# EAGLE design MainCPCB003 (EAGLE 9.4.2)
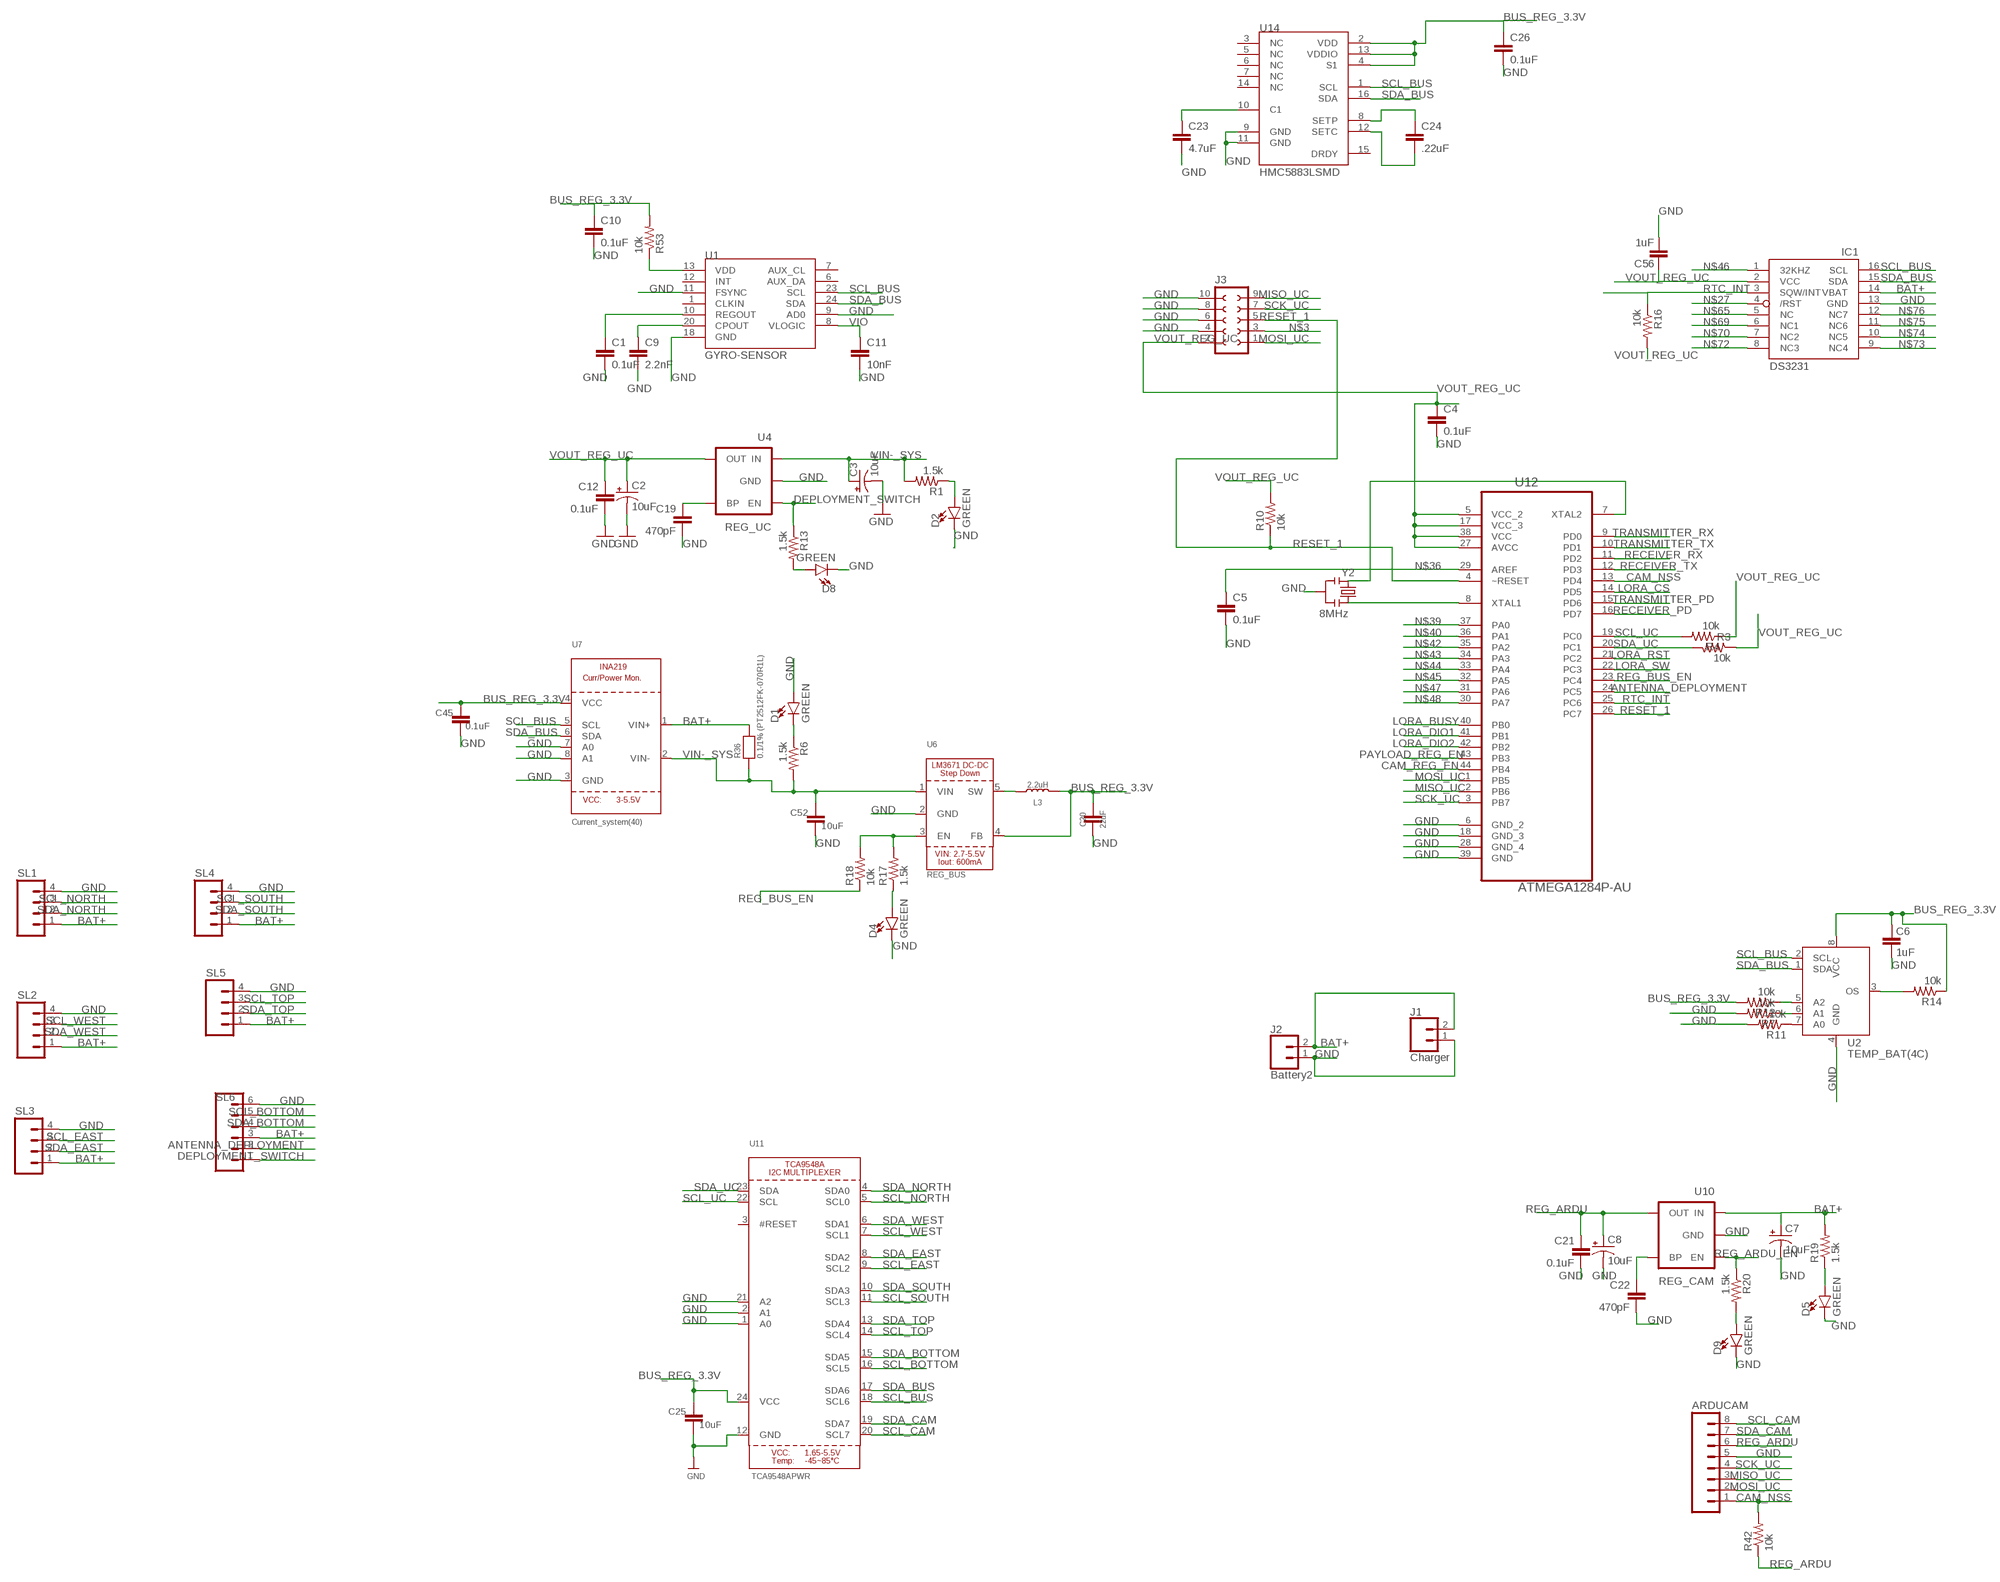
[diagram p0: schematic, sheet 1, part 1 of 2]
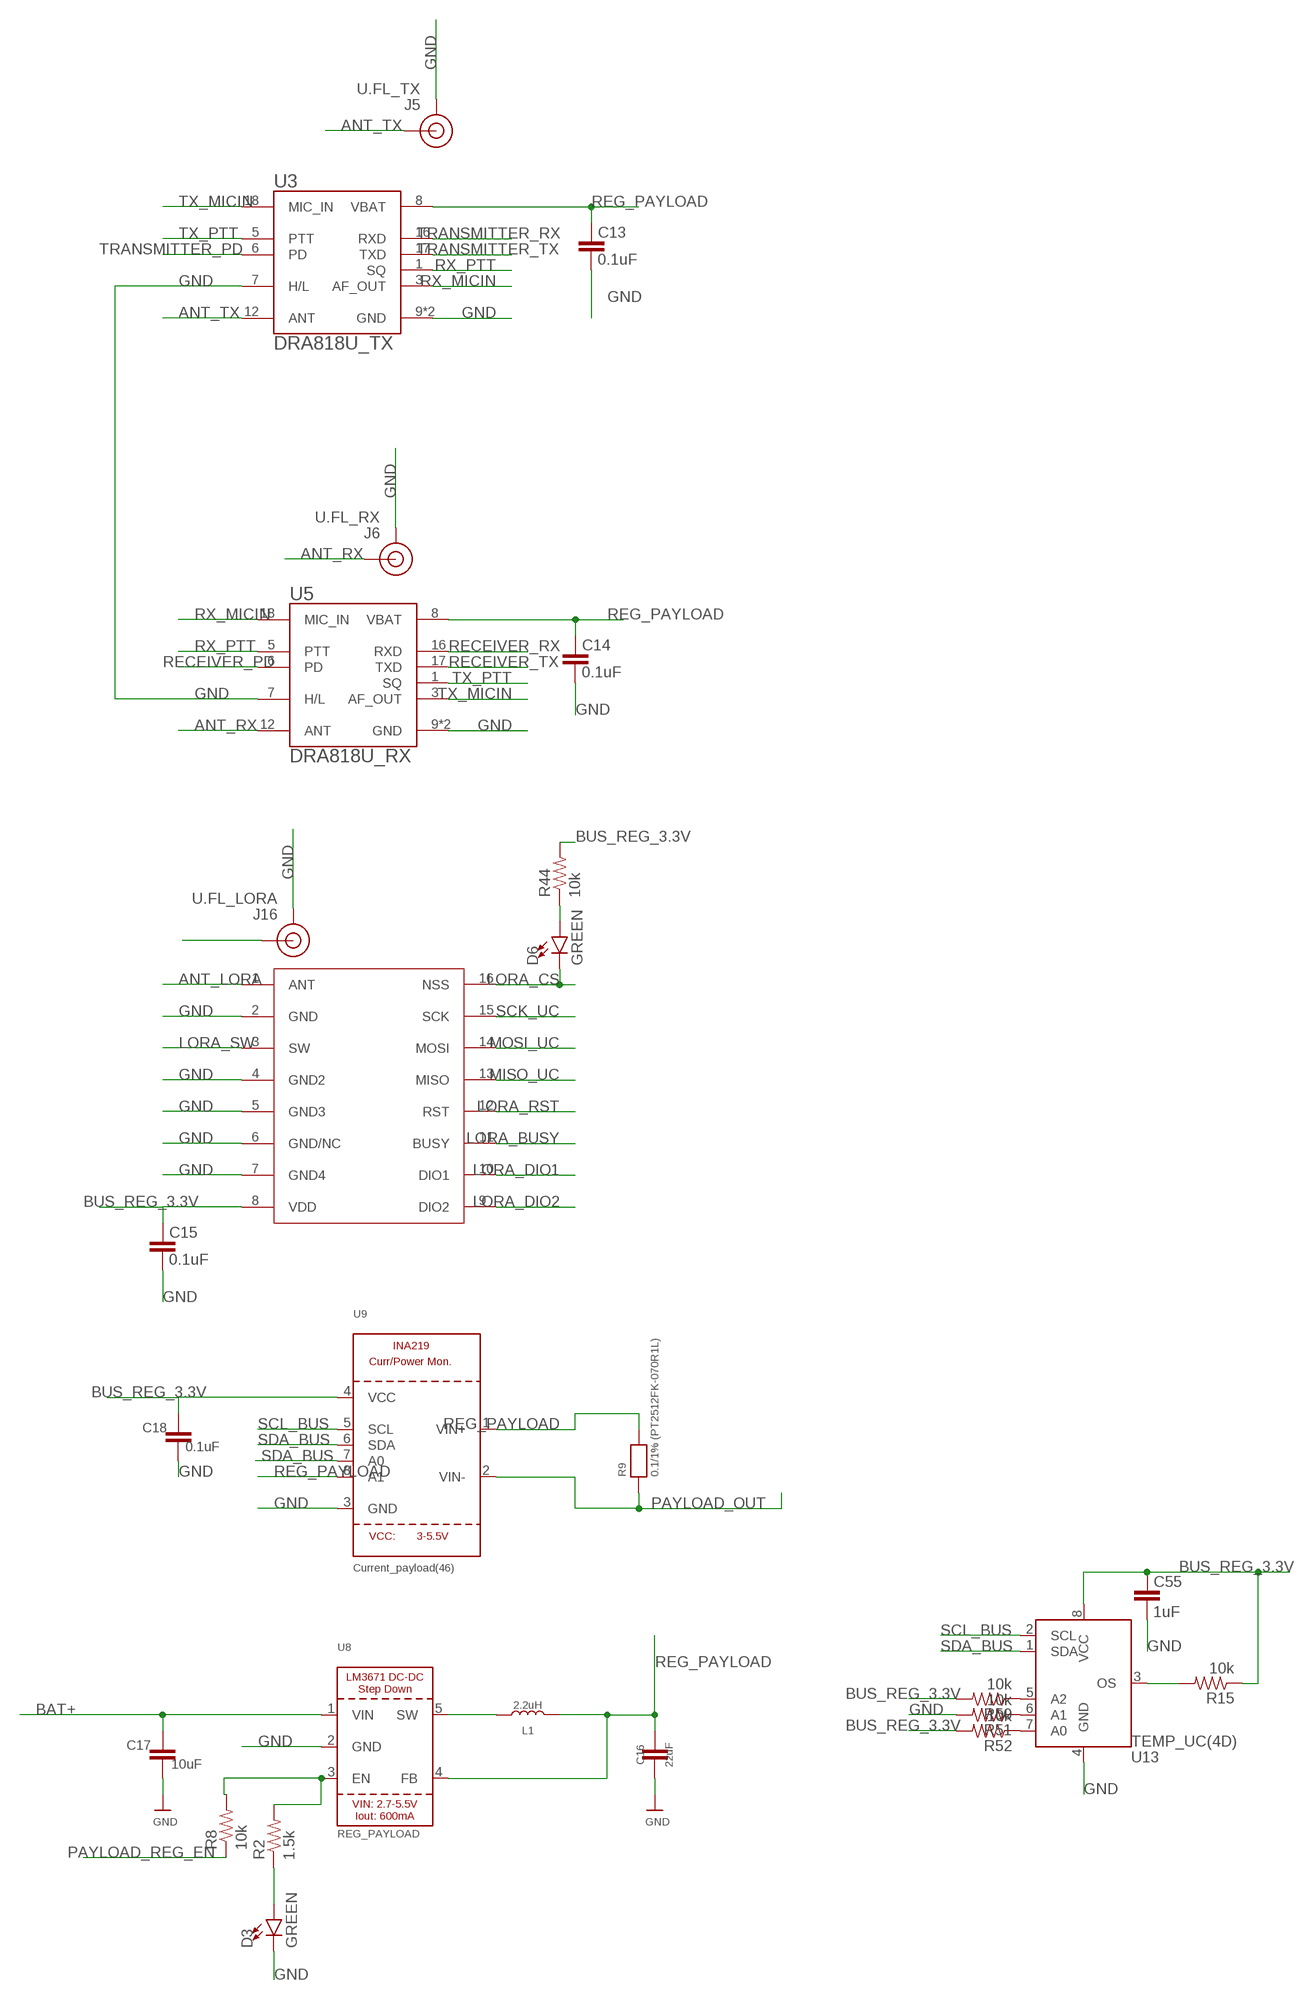
[diagram p1: schematic, sheet 1, part 2 of 2]

## Parts
ARDUCAM  M08  [08P]
C1  0.1uF  CAP0603-CAP  [0603-CAP]
C2  10uF  10UF-POLAR-0603-6.3V-20%(TANT)  [0603-POLAR]
C3  10uF  10UF-POLAR-0603-6.3V-20%(TANT)  [0603-POLAR]
C4  0.1uF  CAP0603-CAP  [0603-CAP]
C5  0.1uF  CAP0603-CAP  [0603-CAP]
C6  1uF  CAP0603-CAP  [0603-CAP]
C7  10uF  10UF-POLAR-0603-6.3V-20%(TANT)  [0603-POLAR]
C8  10uF  10UF-POLAR-0603-6.3V-20%(TANT)  [0603-POLAR]
C9  2.2nF  CAP0603-CAP  [0603-CAP]
C10  0.1uF  CAP0603-CAP  [0603-CAP]
C11  10nF  CAP0603-CAP  [0603-CAP]
C12  0.1uF  CAP0603-CAP  [0603-CAP]
C13  0.1uF  CAP0603-CAP  [0603-CAP]
C14  0.1uF  CAP0603-CAP  [0603-CAP]
C15  0.1uF  CAP0603-CAP  [0603-CAP]
C16  22uF  10UF-0603-6.3V-20%  [0603]
C17  10uF  10UF-0603-6.3V-20%  [0603]
C18  0.1uF  10UF-0603-6.3V-20%  [0603]
C19  470pF  CAP0603-CAP  [0603-CAP]
C20  22uF  10UF-0603-6.3V-20%  [0603]
C21  0.1uF  CAP0603-CAP  [0603-CAP]
C22  470pF  CAP0603-CAP  [0603-CAP]
C23  4.7uF  0.18UF-0603-10V-10%  [0603]
C24  .22uF  0.18UF-0603-10V-10%  [0603]
C25  10uF  10UF-0603-6.3V-20%  [0603]
C26  0.1uF  0.18UF-0603-10V-10%  [0603]
C45  0.1uF  10UF-0603-6.3V-20%  [0603]
C52  10uF  10UF-0603-6.3V-20%  [0603]
C55  1uF  CAP0603-CAP  [0603-CAP]
C56  1uF  CAP0603-CAP  [0603-CAP]
D1  GREEN  LED-GREEN0603  [LED-0603]
D2  GREEN  LED-GREEN0603  [LED-0603]
D3  GREEN  LED-GREEN0603  [LED-0603]
D4  GREEN  LED-GREEN0603  [LED-0603]
D5  GREEN  LED-GREEN0603  [LED-0603]
D6  GREEN  LED-GREEN0603  [LED-0603]
D8  GREEN  LED-GREEN0603  [LED-0603]
D9  GREEN  LED-GREEN0603  [LED-0603]
IC1  DS3231/SO  [SO16W]
J1  Charger  CONN_02  [1X02]
J2  Battery2  CONN_02  [1X02]
J3  SOCKET-10V  [S10V]
J5  U.FL_TX  U.FL2PIN  [U.FL]
J6  U.FL_RX  U.FL2PIN  [U.FL]
J16  U.FL_LORA  U.FL2PIN  [U.FL]
L1  2.2uH  INDUCTOR-0603-33NH  [0603]
L3  2.2uH  INDUCTOR-0603-33NH  [0603]
R1  1.5k  RESISTOR0603-RES  [0603-RES]
R2  1.5k  RESISTOR0603-RES  [0603-RES]
R3  10k  RESISTOR0603-RES  [0603-RES]
R4  10k  RESISTOR0603-RES  [0603-RES]
R6  1.5k  RESISTOR0603-RES  [0603-RES]
R7  10k  RESISTOR0603-RES  [0603-RES]
R8  10k  RESISTOR0402-RES  [0402-RES]
R9  0.1/1% (PT2512FK-070R1L)  RESISTOR2512  [2512]
R10  10k  RESISTOR0402-RES  [0402-RES]
R11  10k  RESISTOR0603-RES  [0603-RES]
R12  10k  RESISTOR0603-RES  [0603-RES]
R13  1.5k  RESISTOR0603-RES  [0603-RES]
R14  10k  RESISTOR0603-RES  [0603-RES]
R15  10k  RESISTOR0603-RES  [0603-RES]
R16  10k  RESISTOR0603-RES  [0603-RES]
R17  1.5k  RESISTOR0603-RES  [0603-RES]
R18  10k  RESISTOR0603-RES  [0603-RES]
R19  1.5k  RESISTOR0603-RES  [0603-RES]
R20  1.5k  RESISTOR0603-RES  [0603-RES]
R36  0.1/1% (PT2512FK-070R1L)  RESISTOR2512  [2512]
R42  10k  RESISTOR0603-RES  [0603-RES]
R44  10k  RESISTOR0603-RES  [0603-RES]
R50  10k  RESISTOR0603-RES  [0603-RES]
R51  10k  RESISTOR0603-RES  [0603-RES]
R52  10k  RESISTOR0603-RES  [0603-RES]
R53  10k  RESISTOR0603-RES  [0603-RES]
SL1  M04  [04P]
SL2  M04  [04P]
SL3  M04  [04P]
SL4  M04  [04P]
SL5  M04  [04P]
SL6  M06  [06P]
U1  GYRO-SENSOR  MPU-6050-1  [QFN-24-4MM2]
U2  TEMP_BAT(4C)  LM75BDP  [SOT505-1]
U3  DRA818U_TX  DRA818U  [DORJI_DRA818U]
U4  REG_UC  V_REG_LDOSMD  [SOT23-5]
U5  DRA818U_RX  DRA818U  [DORJI_DRA818U]
U6  REG_BUS  VREG_LM3671  [SOT23-5]
U7  Current_system(40)  INA219  [SOT23-8]
U8  REG_PAYLOAD  VREG_LM3671  [SOT23-5]
U9  Current_payload(46)  INA219  [SOT23-8]
U10  REG_CAM  V_REG_LDOSMD  [SOT23-5]
U11  TCA9548APWR  TCA9548A  [TSSOP24]
U12  ATMEGA1284P-AU  [QFP80P1200X1200X120-44N]
U13  TEMP_UC(4D)  LM75BDP  [SOT505-1]
U14  HMC5883LSMD  [16LPCC]
U$1  DRF1268  [RESCAV180P1570X1400X300-16]
Y2  RESONATORSMD  [RESONATOR-SMD]

## Nets
ANT_LORA: J16.FEED(SIGNAL) U$1.1(ANT)
ANT_RX: J6.FEED(SIGNAL) U5.12(ANT)
ANT_TX: J5.FEED(SIGNAL) U3.12(ANT)
ANTENNA_DEPLOYMENT: SL6.2 U12.24(PC5)
BAT+: C7.+ C17.1 IC1.14(VBAT) J1.2 J2.2 R19.2 R36.2 SL1.1 SL2.1 SL3.1 SL4.1 SL5.1 SL6.3 U7.1(VIN+) U8.1(VIN) U10.1(IN)
BUS_REG_3.3V: C6.2 C10.1 C15.2 C18.1 C20.1 C25.1 C26.1 C45.1 C55.2 L3.2 R12.2 R14.1 R15.1 R44.2 R50.2 R52.2 R53.2 U2.8(VCC) U6.4(FB) U7.4(VCC) U9.4(VCC) U11.24(VCC) U13.8(VCC) U14.2(VDD) U14.4(S1) U14.13(VDDIO) U$1.8(VDD)
CAM_NSS: ARDUCAM.1 R42.2 U12.13(PD4)
CAM_REG_EN: U12.44(PB4)
DEPLOYMENT_SWITCH: R13.1 SL6.1 U4.3(EN)
GND: ARDUCAM.5 C1.2 C2.- C3.- C4.2 C5.2 C6.1 C7.- C8.- C9.2 C10.2 C11.2 C12.2 C13.1 C14.1 C15.1 C16.2 C17.2 C18.2 C19.2 C20.2 C21.2 C22.2 C23.2 C25.2 C26.2 C45.2 C52.2 C55.1 C56.1 D1.A D2.C D3.C D4.C D5.C D8.C D9.C IC1.13(GND) J1.1 J2.1 J3.4 J3.6 J3.8 J3.10 J5.1(GND) J5.2(GND) J6.1(GND) J6.2(GND) J16.1(GND) J16.2(GND) R7.2 R11.2 R51.2 SL1.4 SL2.4 SL3.4 SL4.4 SL5.4 SL6.6 U1.9(AD0) U1.11(FSYNC) U1.18(GND) U2.4(GND) U3.7(H/L) U3.9(GND) U3.10(GND) U4.2(GND) U5.7(H/L) U5.9(GND) U5.10(GND) U6.2(GND) U7.3(GND) U7.7(A0) U7.8(A1) U8.2(GND) U9.3(GND) U10.2(GND) U11.1(A0) U11.2(A1) U11.12(GND) U11.21(A2) U12.6(GND_2) U12.18(GND_3) U12.28(GND_4) U12.39(GND) U13.4(GND) U14.9(GND) U14.11(GND) U$1.2(GND) U$1.4(GND2) U$1.5(GND3) U$1.6(GND/NC) U$1.7(GND4) Y2.2
LORA_BUSY: U12.40(PB0) U$1.11(BUSY)
LORA_CS: D6.C U12.14(PD5) U$1.16(NSS)
LORA_DIO1: U12.41(PB1) U$1.10(DIO1)
LORA_DIO2: U12.42(PB2) U$1.9(DIO2)
LORA_RST: U12.21(PC2) U$1.12(RST)
LORA_SW: U12.22(PC3) U$1.3(SW)
MISO_UC: ARDUCAM.3 J3.9 U12.2(PB6) U$1.13(MISO)
MOSI_UC: ARDUCAM.2 J3.1 U12.1(PB5) U$1.14(MOSI)
N$1: D5.A R19.1
N$2: D8.A R13.2
N$3: J3.3
N$4: R7.1 U2.6(A1)
N$5: D4.A R17.1
N$6: D3.A R2.1
N$7: D2.A R1.1
N$8: R17.2 R18.2 U6.3(EN)
N$9: R2.2 R8.2 U8.3(EN)
N$10: D1.C R6.1
N$11: D6.A R44.1
N$14: L1.1 U8.5(SW)
N$15: C22.1 U10.4(BP)
N$16: U12.7(XTAL2) Y2.1
N$18: D9.A R20.2
N$21: C24.1 U14.8(SETP)
N$26: C24.2 U14.12(SETC)
N$27: IC1.4(/RST)
N$28: C23.1 U14.10(C1)
N$29: L3.1 U6.5(SW)
N$30: C19.1 U4.4(BP)
N$31: C9.1 U1.20(CPOUT)
N$32: C1.1 U1.10(REGOUT)
N$33: U12.8(XTAL1) Y2.3
N$34: R53.1 U1.13(VDD)
N$35: R12.1 U2.5(A2)
N$36: C5.1 U12.29(AREF)
N$37: R11.1 U2.7(A0)
N$39: U12.37(PA0)
N$40: U12.36(PA1)
N$42: U12.35(PA2)
N$43: U12.34(PA3)
N$44: U12.33(PA4)
N$45: U12.32(PA5)
N$46: IC1.1(32KHZ)
N$47: U12.31(PA6)
N$48: U12.30(PA7)
N$54: R14.2 U2.3(OS)
N$55: R50.1 U13.5(A2)
N$56: R51.1 U13.6(A1)
N$57: R52.1 U13.7(A0)
N$58: R15.2 U13.3(OS)
N$65: IC1.5(NC)
N$69: IC1.6(NC1)
N$70: IC1.7(NC2)
N$72: IC1.8(NC3)
N$73: IC1.9(NC4)
N$74: IC1.10(NC5)
N$75: IC1.11(NC6)
N$76: IC1.12(NC7)
PAYLOAD_OUT: R9.1 U9.2(VIN-)
PAYLOAD_REG_EN: R8.1 U12.43(PB3)
RECEIVER_PD: U5.6(PD) U12.16(PD7)
RECEIVER_RX: U5.16(RXD) U12.11(PD2)
RECEIVER_TX: U5.17(TXD) U12.12(PD3)
REG_ARDU: ARDUCAM.6 C8.+ C21.1 R42.1 U10.5(OUT)
REG_ARDU_EN: R20.1 U10.3(EN)
REG_BUS_EN: R18.1 U12.23(PC4)
REG_PAYLOAD: C13.2 C14.2 C16.1 L1.2 R9.2 U3.8(VBAT) U5.8(VBAT) U8.4(FB) U9.1(VIN+) U9.8(A1)
RESET_1: J3.5 R10.1 U12.4(~RESET) U12.26(PC7)
RTC_INT: IC1.3(SQW/INT) R16.1 U12.25(PC6)
RX_MICIN: U3.3(AF_OUT) U5.18(MIC_IN)
RX_PTT: U3.1(SQ) U5.5(PTT)
SCK_UC: ARDUCAM.4 J3.7 U12.3(PB7) U$1.15(SCK)
SCL_BOTTOM: SL6.5 U11.16(SCL5)
SCL_BUS: IC1.16(SCL) U1.23(SCL) U2.2(SCL) U7.5(SCL) U9.5(SCL) U11.18(SCL6) U13.2(SCL) U14.1(SCL)
SCL_CAM: ARDUCAM.8 U11.20(SCL7)
SCL_EAST: SL3.3 U11.9(SCL2)
SCL_NORTH: SL1.3 U11.5(SCL0)
SCL_SOUTH: SL4.3 U11.11(SCL3)
SCL_TOP: SL5.3 U11.14(SCL4)
SCL_UC: R4.2 U11.22(SCL) U12.19(PC0)
SCL_WEST: SL2.3 U11.7(SCL1)
SDA_BOTTOM: SL6.4 U11.15(SDA5)
SDA_BUS: IC1.15(SDA) U1.24(SDA) U2.1(SDA) U7.6(SDA) U9.6(SDA) U9.7(A0) U11.17(SDA6) U13.1(SDA) U14.16(SDA)
SDA_CAM: ARDUCAM.7 U11.19(SDA7)
SDA_EAST: SL3.2 U11.8(SDA2)
SDA_NORTH: SL1.2 U11.4(SDA0)
SDA_SOUTH: SL4.2 U11.10(SDA3)
SDA_TOP: SL5.2 U11.13(SDA4)
SDA_UC: R3.2 U11.23(SDA) U12.20(PC1)
SDA_WEST: SL2.2 U11.6(SDA1)
TRANSMITTER_PD: U3.6(PD) U12.15(PD6)
TRANSMITTER_RX: U3.16(RXD) U12.9(PD0)
TRANSMITTER_TX: U3.17(TXD) U12.10(PD1)
TX_MICIN: U3.18(MIC_IN) U5.3(AF_OUT)
TX_PTT: U3.5(PTT) U5.1(SQ)
VIN-_SYS: C3.+ C52.1 R1.2 R6.2 R36.1 U4.1(IN) U6.1(VIN) U7.2(VIN-)
VIO: C11.1 U1.8(VLOGIC)
VOUT_REG_UC: C2.+ C4.1 C12.1 C56.2 IC1.2(VCC) J3.2 R3.1 R4.1 R10.2 R16.2 U4.5(OUT) U12.5(VCC_2) U12.17(VCC_3) U12.27(AVCC) U12.38(VCC)
Unconnected: U1.1(CLKIN) U1.6(AUX_DA) U1.7(AUX_CL) U1.12(INT) U11.3(#RESET) U14.3(NC) U14.5(NC) U14.6(NC) U14.7(NC) U14.14(NC) U14.15(DRDY)

## Notes on the sheet
- 8MHz

## Library data of the parts
ARDUCAM = con-amp-quick:M08: AMP QUICK CONNECTOR; OC_FARNELL: unknown; OC_NEWARK: unknown
C1 C4-C6 C9-C15 C19 C21 C22 C55 C56 = SparkFun:CAP: Capacitor Standard 0603 ceramic capacitor, and 0.1" leaded capacitor.
C2 C3 C7 C8 = SparkFun-Capacitors:10UF-POLAR: 10.0µF polarized capacitors A capacitor is a passive two-terminal electrical component used to store electrical energy temporarily in an electric field.; PROD_ID: CAP-13210
C16 C18 C20 C45 = SparkFun-Capacitors:10UF: 10.0µF ceramic capacitors A capacitor is a passive two-terminal electrical component used to store electrical energy temporarily in an electric field.; PROD_ID: CAP-11015; VALUE: 10uF
C17 C25 C52 = SparkFun-Capacitors:10UF: 10.0µF ceramic capacitors A capacitor is a passive two-terminal electrical component used to store electrical energy temporarily in an electric field.; PROD_ID: CAP-11015
C23 C24 C26 = SparkFun-Capacitors:0.18UF: 0.18µF ceramic capacitor A capacitor is a passive two-terminal electrical component used to store electrical energy temporarily in an electric field.; PROD_ID: CAP-12380; VALUE: 0.18uF
D1-D6 D8 D9 = SparkFun-LED:LED-GREEN: Green SMD LED Used in manufacturing of various products at SparkFun Packages: 0603 - SMD 0603 package [Product Link] <http://www.futureelectronics.com/en/technologies/semiconductors/optoelectronics/leds/Pages/9894312-LTST-C190GKT.aspx?CrossPart=HSMG-C190&IM=0> LilyPad 1206 - SMD1206 LilyPad package [Product Link] <http://www.futureelectronics.com/en/Technologies/Product.aspx?ProductID=IN150NGHARVATEKCORPORATION2049943&IM=0> 1206 - SMD1206 package [Product Link] <http://www.futureelectronics.com/en/technologies/semiconductors/optoelectronics/leds/Pages/8315665-LTST-C150KGKT.aspx?IM=0> 1206 Bottom Mount -SMD 1206 Bottom Mount [Product Link] <http://www.digikey.com/product-detail/en/lite-on-inc/LTST-C230KGKT/160-1456-1-ND/386854> SparkFun Products: Pro Mini 328 -5V <https://www.sparkfun.com/products/821> RedBoard <https://www.sparkfun.com/products/12757> MP3 Trigger <https://www.sparkfun.com/products/13720> Makey Makey <https://www.sparkfun.com/products/11076>; PROD_ID: DIO-00821
IC1 = DS3231:DS3231: The DS3231 is a low-cost, extremely accurate I²C real-time clock (RTC) with an integrated temperature-compensated crystal oscillator (TCXO) and crystal. The device incorporates a battery input, and maintains accurate timekeeping when main power to the device is interrupted.; AVAILABILITY: Unavailable; MF: Maxim Integrated; MP: DS3231; PACKAGE: SOIC-16 Maxim Integrated; PRICE: None
J1 J2 = SparkFun-Connectors:CONN_02: Multi connection point. Often used as Generic Header-pin footprint for 0.1 inch spaced/style header connections On any of the 0.1 inch spaced packages, you can populate with these: Break Away Headers - Straight <https://www.sparkfun.com/products/116> (PRT-00116) Break Away Male Headers - Right Angle <https://www.sparkfun.com/products/553> (PRT-00553) Female Headers <https://www.sparkfun.com/products/115> (PRT-00115) Break Away Headers - Machine Pin <https://www.sparkfun.com/products/117> (PRT-00117) Break Away Female Headers - Swiss Machine Pin <https://www.sparkfun.com/products/743> (PRT-00743) For SCREWTERMINALS and SPRING TERMINALS visit here: Screw Terimnals on SparkFun.com <https://www.sparkfun.com/search/results?term=Screw+Terminals> (5mm/3.5mm/2.54mm spacing) This device is also useful as a general connection point to wire up your design to another part of your project. Our various solder wires solder well into these plated through hole pads. Hook-Up Wire - Assortment (Stranded, 22 AWG) <https://www.sparkfun.com/products/11375> (PRT-11375) Hook-Up Wire - Assortment (Solid Core, 22 AWG) <https://www.sparkfun.com/products/11367> (PRT-11367) View the entire wire category on our website here <https://www.sparkfun.com/categories/141> Special notes: Molex polarized connector foot print use with: PRT-08233 with associated crimp pins and housings. 2.54_SCREWTERM for use with PRT-10571. 3.5mm Screw Terminal footprints for PRT-08084 5mm Screw Terminal footprints for use with PRT-08432
J3 = con-3m-skt-header:SOCKET-10: 10 pin PCB Socket (3m 85xx/51xx)
J5 J6 J16 = SparkFun-Connectors:U.FL2PIN: SMD Antenna Connector - U.FL 2mm height, 3.0mm x 3.0mm receptacle size. SparkFun Products: SparkFun WiFi Shield - ESP8266 <https://www.sparkfun.com/products/13287> SparkFun ESP8266 Thing <https://www.sparkfun.com/products/13231> SparkFun MiniGen - Pro Mini Signal Generator Shield <https://www.sparkfun.com/products/11420>; PROD_ID: CONN-09193; SF_ID: WRL-09144; VALUE: U.FL
L1 L3 = SparkFun-Coils:INDUCTOR: Inductors Resist changes in electrical current. Basically a coil of wire. SparkFun Products: SparkFun Load Cell Amplifier - HX711 <https://www.sparkfun.com/products/13879> IOIO-OTG - V2.2 <https://www.sparkfun.com/products/13613>; PROD_ID: NDUC-07874; VALUE: 33nH/±5%/500mA
R1-R4 R6-R8 R10-R20 R42 R44 R50-R53 = SparkFun:RESISTOR: Resistor Basic schematic elements and footprints for 0603, 1206, and PTH resistors.
R9 R36 = microbuilder:RESISTOR: Resistors For new designs, use the packages preceded by an '_' character since they are more reliable: The following footprints should be used on most boards: _0402 - Standard footprint for regular board layouts _0603 - Standard footprint for regular board layouts _0805 - Standard footprint for regular board layouts _1206 - Standard footprint for regular board layouts For extremely tight-pitch boards where space is at a premium, the following 'micro-pitch' footprints can be used (smaller pads, no silkscreen outline, etc.): _0402MP - Micro-pitch footprint for very dense/compact boards _0603MP - Micro-pitch footprint for very dense/compact boards _0805MP - Micro-pitch footprint for very dense/compact boards _1206MP - Micro-pitch footprint for very dense/compact boards
SL1-SL5 = con-amp-quick:M04: AMP QUICK CONNECTOR; OC_FARNELL: unknown; OC_NEWARK: unknown
SL6 = con-amp-quick:M06: AMP QUICK CONNECTOR; OC_FARNELL: unknown; OC_NEWARK: unknown
U1 = Testing:MPU-6050
U2 U13 = LM75B:LM75B: Digital temperature sensor and thermal watchdog AAL Eindhoven MK; AVAILABILITY: Unavailable; MF: NXP Semiconductors; MP: LM75B; PACKAGE: None; PRICE: None
U3 U5 = DRA818U:DRA818U: VHF Band Voice Transceiver Module; AVAILABILITY: Unavailable; MF: DORJI; MP: DRA818V; PACKAGE: Package Analog Devices; PRICE: None
U4 U10 = SparkFun:V_REG_LDO: Voltage Regulator LDO Standard 150mA LDO voltage regulator in SOT-23 layout. Micrel part MIC5205. BP (by-pass) pin is used to lower output noise with 470pF cap.
U6 U8 = microbuilder:VREG_LM3671: LM3671 - 600mA DC-DC Step-Down Converter VIN: 2.7-5.5V Load Current: 600mA Switching Frequency: 2MHz Iq: 16uA
U7 U9 = microbuilder:INA219: INA219 - I2C Current/Power Monitor Voltage Range: 0-26V Accuracy: 0.5% Temperature: -40°C - 125°C
U11 = microbuilder:TCA9548A: TCA9548A I2C Multiplexer
U12 = ATMEGA1284P-AU:ATMEGA1284P-AU: Microcontroller with Programmable Flash; AVAILABILITY: Unavailable; DESCRIPTION: AVR AVR® ATmega Microcontroller IC 8-Bit 20MHz 128KB _64K x 16_ FLASH 44-TQFP _10x10_; MF: Microchip; MP: ATMEGA1284P-AU; PACKAGE: TQFP-44 Microchip; PRICE: None
U14 = SparkFun:HMC5883L: 3 Axis Digital Compass IC
U$1 = DRF1268:DRF1268
Y2 = SparkFun:RESONATOR: Resonator Small SMD resonator. This is the itty bitty 10/20MHz resonators with built in caps. CSTCE10M0G55 and CSTCE20M0V53. Footprint has been reviewed closely but hasn't been tested yet.

## Board
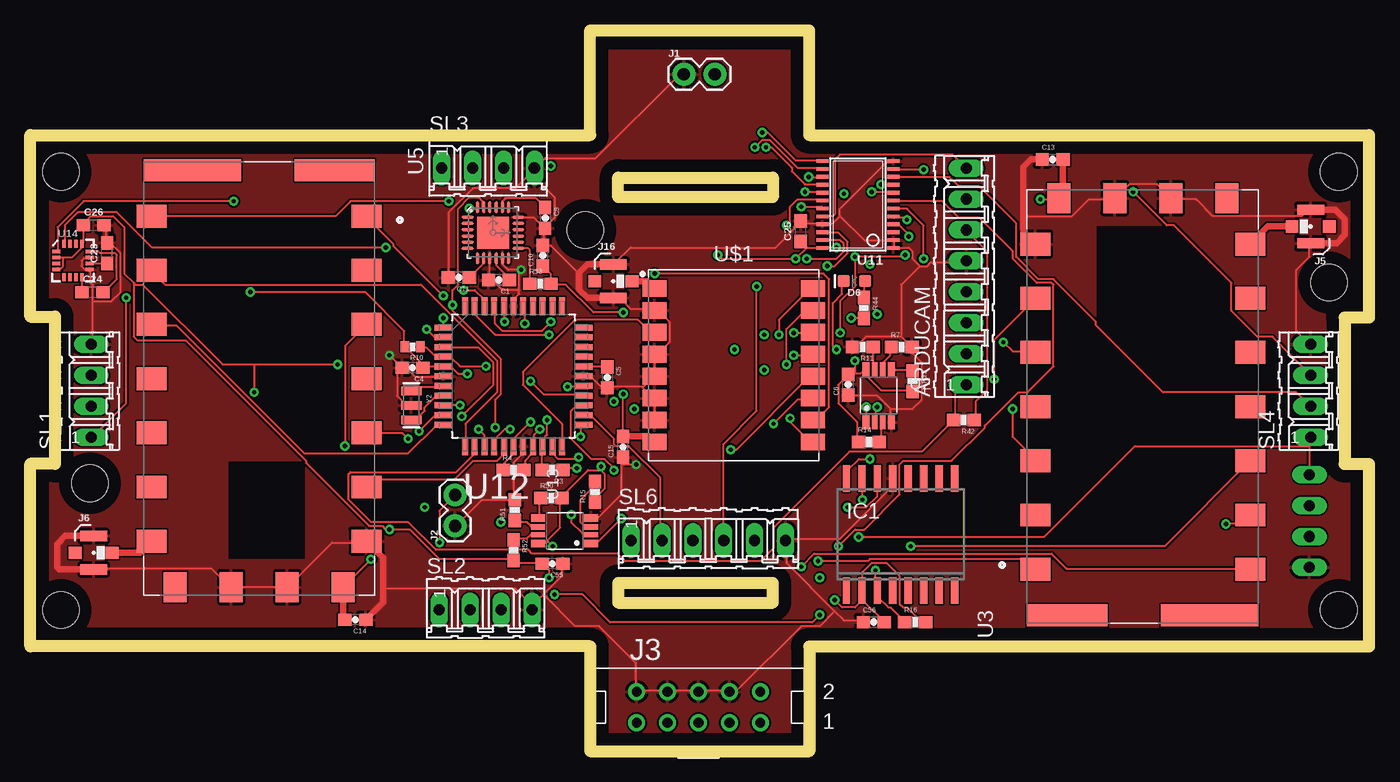
[diagram p2: board, top side]
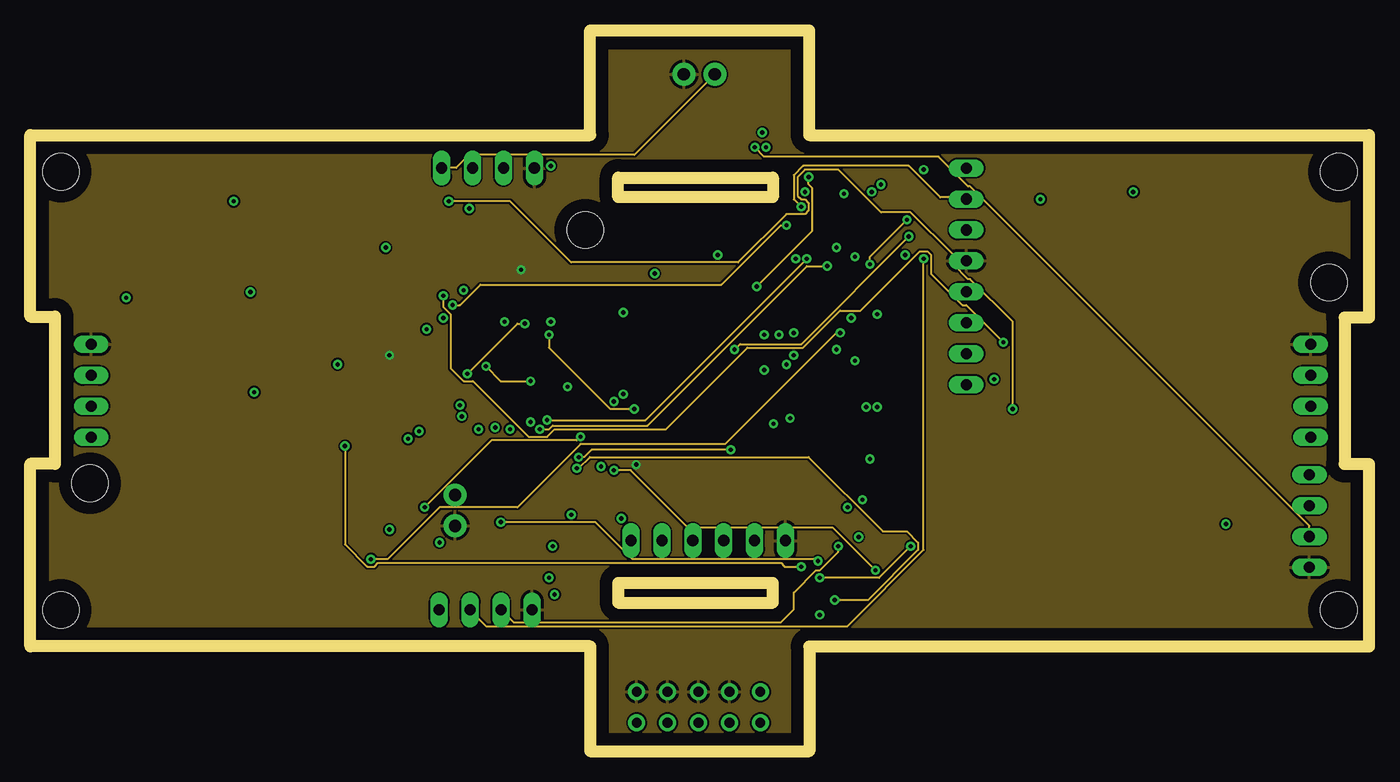
[diagram p3: board, inner layer Route2]
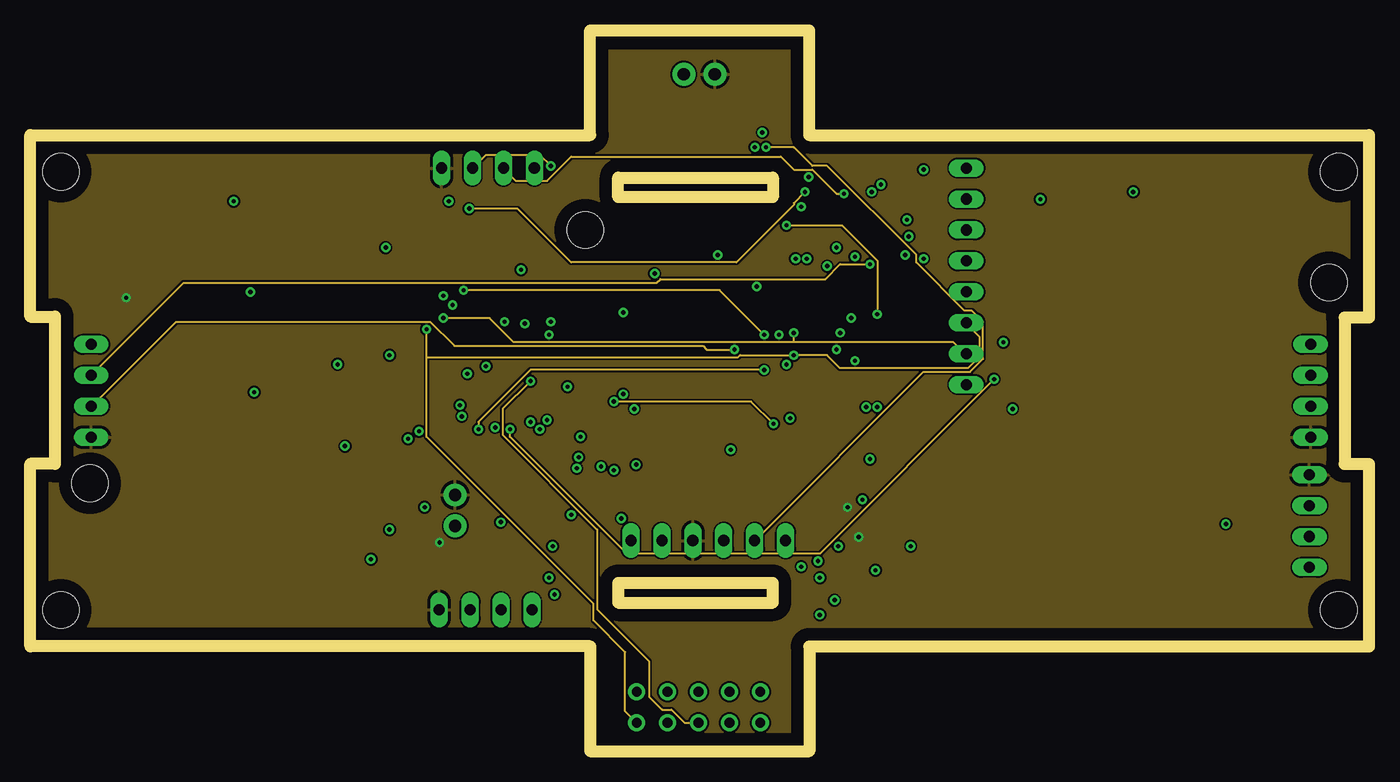
[diagram p4: board, inner layer Route15]
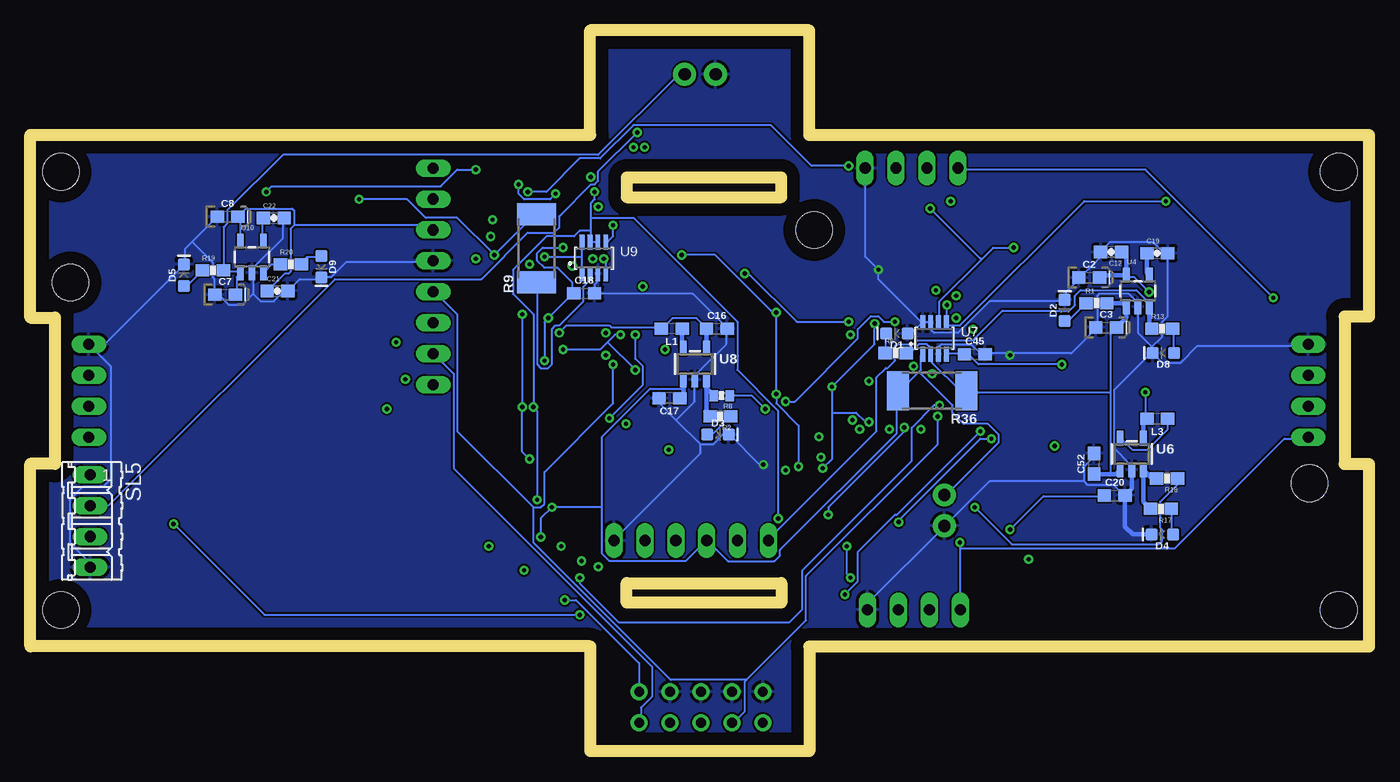
[diagram p5: board, bottom side, seen from below]

Size 110 x 59.2 mm. Coordinates in mm from the lower left corner, seen from the top.
Outline: 0,50.6 46,50.6 46,59.2 64,59.2 64,50.6 110,50.6 110,35.6 108,35.6 108,23.6 110,23.6 110,8.6 64,8.6 64,0 46,0 46,8.6 0,8.6 0,23.6 2,23.6 2,35.7 0,35.7 0,50.6
Outline: 48.3,47.1 61,47.1 61,45.5 48.3,45.5 48.3,47.1
Outline: 48.3,12.2 61,12.2 61,13.8 48.3,13.8 48.3,12.2
Copper layers (1+2*15+16): Top 0.035mm / dielectric 0.2mm / Route2 0.0175mm / dielectric 1.065mm / Route15 0.0175mm / dielectric 0.2mm / Bottom 0.035mm
Design rules "default *": minimum track width 6mil, minimum drill 0.35mm, track to track 6mil, track to pad 6mil, pad to pad 6mil, via to via 6mil, smd to smd 6mil, copper to edge 40mil, drill to drill 6mil, minimum pad ring 10mil, minimum via ring 8mil, stop-mask expansion 4mil, vias tented up to drill 0mil, thermal gap 10mil
Holes 3 mm at 2.5,47.6 2.5,11.6 107.5,11.6 107.5,47.6 4.9,22 45.6,42.8 106.7,38.5

### Footprints (pad centres in the part's own frame; a part is rotated, then mirrored left to right if it is on the bottom)
08P = drill 0.914 long: 1 -8.89,0; 2 -6.35,0; 3 -3.81,0; 4 -1.27,0; 5 1.27,0; 6 3.81,0; 7 6.35,0; 8 8.89,0
0603-CAP = smd 1.1 x 1: 1 -0.85,0; 2 0.85,0
0603-POLAR = smd 1.1 x 1: + 0.85,0; - -0.85,0
0603 = smd 1.1 x 1: 1 -0.85,0; 2 0.85,0
LED-0603 = smd 1 x 1: A -0.877,0; C 0.877,0
SO16W = smd 0.6 x 2.2: 1 -4.445,-4.6; 2 -3.175,-4.6; 3 -1.905,-4.6; 4 -0.635,-4.6; 5 0.635,-4.6; 6 1.905,-4.6; 7 3.175,-4.6; 8 4.445,-4.6; 9 4.445,4.6; 10 3.175,4.6; 11 1.905,4.6; 12 0.635,4.6; 13 -0.635,4.6; 14 -1.905,4.6; 15 -3.175,4.6; 16 -4.445,4.6
1X02 = drill 1.016 pad 1.88: 1 0,0; 2 2.54,0
S10V = drill 0.8 pad 1.4: 1 5.08,-1.27; 2 5.08,1.27; 3 2.54,-1.27; 4 2.54,1.27; 5 0,-1.27; 6 0,1.27; 7 -2.54,-1.27; 8 -2.54,1.27; 9 -5.08,-1.27; 10 -5.08,1.27
U.FL = smd 2.2 x 0.85: 1 0,1.375; 2 0,-1.375 | smd 1.05 x 1: FEED 1.525,0; NC -1.525,0
0603-RES = smd 1.1 x 1: 1 -0.85,0; 2 0.85,0
0402-RES = smd 0.7 x 0.9: 1 -0.65,0; 2 0.65,0
2512 = smd 1.8 x 3.2: 1 -2.8,0; 2 2.8,0
04P = drill 0.914 long: 1 -3.81,0; 2 -1.27,0; 3 1.27,0; 4 3.81,0
06P = drill 0.914 long: 1 -6.35,0; 2 -3.81,0; 3 -1.27,0; 4 1.27,0; 5 3.81,0; 6 6.35,0
QFN-24-4MM2 = smd 1.016 x 0.254: 1 -2.066,1.257; 2 -2.066,0.75; 3 -2.066,0.247; 4 -2.066,-0.287; 5 -2.066,-0.792; 6 -2.066,-1.297; 13 2.086,-1.297; 14 2.086,-0.792; 15 2.086,-0.287; 16 2.086,0.247; 17 2.086,0.75; 18 2.086,1.257 | smd 0.254 x 1.016: 7 -1.267,-2.122; 8 -0.762,-2.122; 9 -0.258,-2.122; 10 0.278,-2.122; 11 0.78,-2.122; 12 1.287,-2.122; 19 1.287,2.082; 20 0.78,2.082; 21 0.278,2.082; 22 -0.258,2.082; 23 -0.762,2.082; 24 -1.267,2.082 | smd 2.616 x 2.616: P$1 0.02,-0.01
SOT505-1 = smd 0.6 x 1.15: 1 -1.05,-2.175; 4 1.05,-2.175; 5 1.05,2.175; 8 -1.05,2.175 | smd 0.45 x 1.15: 2 -0.325,-2.175; 3 0.325,-2.175; 6 0.325,2.175; 7 -0.325,2.175
DORJI_DRA818U = smd 1.88 x 2.47: 1 -13.35,8.825; 2 -8.9,8.825; 3 -4.45,8.825; 4 0,8.825; 5 4.45,8.825; 6 8.9,8.825; 7 13.35,8.825; 12 13.35,-8.825; 13 8.9,-8.825; 14 4.45,-8.825; 15 0,-8.825; 16 -4.45,-8.825; 17 -8.9,-8.825; 18 -13.35,-8.825 | smd 2.47 x 1.88: 8 17.125,6.9; 9 17.125,2.3; 10 17.125,-2.3; 11 17.125,-6.9 | smd 1.8 x 6.6: P2 -17.125,6.2 | smd 1.8 x 8: P3 -17.125,-5.5
SOT23-5 = smd 0.55 x 1.2: 1 -0.95,-1.3; 2 0,-1.3; 3 0.95,-1.3; 4 0.95,1.3; 5 -0.95,1.3
SOT23-8 = smd 0.4 x 1.2: 1 -0.975,-1.3; 2 -0.325,-1.3; 3 0.325,-1.3; 4 0.975,-1.3; 5 0.975,1.3; 6 0.325,1.3; 7 -0.325,1.3; 8 -0.975,1.3
TSSOP24 = smd 0.305 x 0.991: 1 -3.575,-2.918; 2 -2.925,-2.918; 3 -2.275,-2.918; 4 -1.625,-2.918; 5 -0.975,-2.918; 6 -0.325,-2.918; 7 0.325,-2.918; 8 0.975,-2.918; 9 1.625,-2.918; 10 2.275,-2.918; 11 2.925,-2.918; 12 3.575,-2.918; 13 3.575,2.918; 14 2.925,2.918; 15 2.275,2.918; 16 1.625,2.918; 17 0.975,2.918; 18 0.325,2.918; 19 -0.325,2.918; 20 -0.975,2.918; 21 -1.625,2.918; 22 -2.275,2.918; 23 -2.925,2.918; 24 -3.575,2.918
QFP80P1200X1200X120-44N = smd 1.473 x 0.508: 1 -5.74,3.988; 2 -5.74,3.2; 3 -5.74,2.388; 4 -5.74,1.6; 5 -5.74,0.787; 6 -5.74,0; 7 -5.74,-0.787; 8 -5.74,-1.6; 9 -5.74,-2.388; 10 -5.74,-3.2; 11 -5.74,-3.988; 23 5.74,-3.988; 24 5.74,-3.2; 25 5.74,-2.388; 26 5.74,-1.6; 27 5.74,-0.787; 28 5.74,0; 29 5.74,0.787; 30 5.74,1.6; 31 5.74,2.388; 32 5.74,3.2; 33 5.74,3.988 | smd 0.508 x 1.473: 12 -3.988,-5.74; 13 -3.2,-5.74; 14 -2.388,-5.74; 15 -1.6,-5.74; 16 -0.787,-5.74; 17 0,-5.74; 18 0.787,-5.74; 19 1.6,-5.74; 20 2.388,-5.74; 21 3.2,-5.74; 22 3.988,-5.74; 34 3.988,5.74; 35 3.2,5.74; 36 2.388,5.74; 37 1.6,5.74; 38 0.787,5.74; 39 0,5.74; 40 -0.787,5.74; 41 -1.6,5.74; 42 -2.388,5.74; 43 -3.2,5.74; 44 -3.988,5.74
16LPCC = smd 0.65 x 0.28: 1 -1.37,0.75; 2 -1.37,0.25; 3 -1.37,-0.25; 4 -1.37,-0.75; 9 1.37,-0.75; 10 1.37,-0.25; 11 1.37,0.25; 12 1.37,0.75 | smd 0.28 x 0.65: 5 -0.75,-1.37; 6 -0.25,-1.37; 7 0.25,-1.37; 8 0.75,-1.37; 13 0.75,1.37; 14 0.25,1.37; 15 -0.25,1.37; 16 -0.75,1.37
RESCAV180P1570X1400X300-16 = smd 1.982 x 1.372: 1 -6.515,6.3; 2 -6.515,4.5; 3 -6.515,2.7; 4 -6.515,0.9; 5 -6.515,-0.9; 6 -6.515,-2.7; 7 -6.515,-4.5; 8 -6.515,-6.3; 9 6.515,-6.3; 10 6.515,-4.5; 11 6.515,-2.7; 12 6.515,-0.9; 13 6.515,0.9; 14 6.515,2.7; 15 6.515,4.5; 16 6.515,6.3
RESONATOR-SMD = smd 0.7 x 1.7: 1 -1.2,0; 2 0,0; 3 1.2,0

### Placement (x,y rotation side)
ARDUCAM  76.9,39 90 top
C1  38.5,38.7 180 top
C2  23,38.9 0 bottom
C3  21.6,34.8 0 bottom
C4  31.4,31.5 180 top
C5  47.4,30.7 270 top
C6  67.2,30.1 90 top
C7  94,37.5 0 bottom
C8  93.8,43.9 0 bottom
C9  42.3,43.8 270 top
C10  42.1,40.7 90 top
C11  35.2,38.9 180 top
C12  21.2,41 180 bottom
C13  84,48.6 0 top
C14  26.7,10.8 180 top
C15  48.7,25 90 top
C16  53.6,34.7 0 bottom
C17  57.5,29 180 bottom
C18  64.5,37.6 0 bottom
C19  17.4,40.9 0 bottom
C20  20.9,21 0 bottom
C21  89.7,37.8 0 bottom
C22  90,43.8 0 bottom
C23  6.3,40.9 90 top
C24  5.1,37.7 0 top
C25  63.3,42.7 90 top
C26  5.2,43.2 0 top
C45  32.4,32.6 0 bottom
C52  22.6,23.6 90 bottom
C55  42.9,15.4 180 top
C56  69.3,10.6 0 top
D1  38.8,34.3 180 bottom
D2  25,36.2 90 bottom
D3  53.5,26 0 bottom
D4  17,17.8 180 bottom
D5  97.4,39.1 90 bottom
D6  67.7,38.6 180 top
D8  16.9,32.7 180 bottom
D9  86.1,39.8 270 bottom
IC1  71.5,17.8 0 top
J1  53.7,55.6 0 top
J2  34.9,18.5 90 top
J3  54.9,3.6 0 top
J5  105.2,43.1 180 top
J6  5.2,16.3 0 top
J16  47.9,38.6 0 top
L1  57.3,34.7 180 bottom
L3  17.4,27.3 180 bottom
R1  22.4,36.8 0 bottom
R2  53.3,27.5 180 bottom
R3  42.9,23.1 180 top
R4  39.7,23.1 0 top
R6  38.9,32.7 0 bottom
R7  71.6,33.2 0 top
R8  53.2,29.2 180 bottom
R9  68.4,41.3 90 bottom
R10  31.4,33.2 180 top
R11  68.4,33.2 180 top
R12  72.5,30.4 270 top
R13  17,34.7 0 bottom
R14  68.9,25.4 0 top
R15  46.4,21.3 90 top
R16  72.7,10.6 0 top
R17  17.1,19.9 180 bottom
R18  16.6,22.4 180 bottom
R19  95,39.5 0 bottom
R20  88.6,40 0 bottom
R36  35.9,29.6 180 bottom
R42  76.7,27.2 180 top
R44  68.5,36.4 270 top
R50  42.8,20.8 0 top
R51  39.8,19.8 90 top
R52  39.7,16.5 270 top
R53  41.9,38.4 0 top
SL1  5,29.6 90 top
SL2  37.4,11.6 0 top
SL3  37.6,47.9 0 top
SL4  105.2,29.6 90 top
SL5  105.1,18.9 270 bottom
SL6  55.7,17.3 0 top
U1  38,42.6 0 top
U2  69.7,29.2 0 top
U3  91.4,28.3 90 top
U4  19,37.8 0 bottom
U5  18.8,30.6 270 top
U6  19.5,24.4 0 bottom
U7  35.7,33.9 0 bottom
U8  55.4,31.8 0 bottom
U9  63.7,40.5 0 bottom
U10  91.8,40.6 0 bottom
U11  68,44.9 90 top
U12  39.7,30.8 0 top
U13  43.9,18.1 90 top
U14  3.5,40.3 0 top
U$1  57.8,31.7 0 top
Y2  31.3,28.4 270 top

### Tracks (layer width: path | path; a pad name or v marks a point on that pad's centre or on a via)
ANT_LORA
  Top 0.525: J16.FEED 50.69,38.6 U$1.1
ANT_RX
  Top 0.525: U5.12 9.02,16.3 J6.FEED
ANT_TX
  Top 0.525: U3.12 101.67,43.1 J5.FEED
ANTENNA_DEPLOYMENT
  Top 0.152: U12.24 45.51,27.5 46.12,27.5 47.95,25.67 47.95,25.21 48.1,25.06 49.16,25.06 51.76,22.47 51.76,17.44 SL6.2
BAT+  (via drill 0.35)
  Top 0.152: v33.62,17.13 33.62,19.73 34.84,20.94 J2.2 | 105.1,25.06 105.1,25.67 SL4.1 | 105.1,25.06 105.1,22.77 SL5.1 | v67.15,20.03 68.67,20.03 69.59,20.94 69.59,22.32 IC1.14 | 105.1,25.06 90.77,25.06 83.3,17.59 v68.06,17.59 | v7.86,37.25 7.86,28.56 5.12,25.82 SL1.1
  Route2 0.152: SL3.1 33.92,47.92 34.99,47.92 36.06,48.99 49.62,48.99 56.17,55.54 J1.2
  Bottom 0.152: C7.+ 93.06,37.56 93.06,38.93 92.75,39.23 U10.1 92.75,39.38 94.12,39.38 R19.2 94.12,39.54 94.12,43.04 93.82,43.35 93.82,44.41 89.25,48.99 63.34,48.99 56.78,55.54 56.33,55.54 J1.2 | 36.97,31.16 38.65,29.48 R36.2 38.8,29.48 38.8,26.13 48.4,16.52 48.4,16.07 48.86,15.61 52.67,15.61 54.35,17.29 SL6.3 54.5,17.29 56.17,15.61 62.42,15.61 63.03,16.22 63.03,20.03 | 36.97,31.16 36.82,31.31 36.82,32.53 U7.1 | v33.62,17.13 33.62,16.68 | 33.62,16.68 33.62,11.65 SL2.1 | 33.62,16.68 15.94,16.68 6.95,25.67 5.12,25.67 SL1.1 | 36.97,31.16 34.23,28.41 34.23,27.8 33.31,26.89 31.33,26.89 30.42,25.97 30.42,25.36 34.84,20.94 J2.2 | 56.35,29.78 59.07,29.78 63.03,25.82 63.03,20.03 | 63.03,20.03 v67.15,20.03 68.06,19.12 v68.06,17.59 | v7.86,37.25 18.38,47.77 33.77,47.77 SL3.1
  Bottom 0.386: U8.1 56.35,29.78 56.35,29.3 C17.1
  pour Route15: 0.5,49.2 1.4,50.1 1.5,50.1 46.2,50.1 46.5,50.4 46.5,58.3 46.8,58.6 63.1,58.6 63.5,58.2 63.5,50.3 63.8,50 109,50 109.1,49.9 109.4,49.6 109.4,44.6 109.4,36.4 109.2,36.2 109.1,36.1 107.6,36.1 107.4,35.9 107.4,23.2 107.6,23 107.9,23 109.3,23 109.5,22.8 109.3,22.6 109.3,9.2 64.2,9.2 63.6,8.6 63.5,8.6 63.5,0.7 63.3,0.5 47.3,0.5 46.5,1.3 46.5,8.6 46,9.1 45.9,9.2 1.1,9.2 0.3,10 0.3,22.4 1,23.1 2.1,23.1 2.8,23.8 2.8,35.9 2.3,36.4 0.6,36.4 0.5,36.5
BUS_REG_3.3V  (via drill 0.35)
  Top 0.152: U14.2 2.7,40.55 | 2.7,40.55 3.42,40.55 4.25,41.38 U14.13 4.35,41.77 C26.1 4.36,43.35 4.97,43.96 6.8,43.96 7.71,43.04 7.71,39.23 8.47,38.47 | U14.4 2.26,39.68 2.55,39.68 2.68,39.81 2.68,40.53 2.7,40.55 | C10.1 42.75,39.2 R53.2 42.76,38.32 43.98,38.32 46.27,36.03 v48.71,36.03 | 67.76,31 68.22,31 68.37,31.16 | 67.76,31 67.3,31 C6.2 67.15,30.85 66.39,30.09 66.39,28.56 67.91,27.04 67.91,25.52 R14.1 | 68.37,31.16 68.52,31.31 U2.8 68.37,31.16 | 68.37,31.16 69.89,29.63 72.48,29.63 R12.2 | 63.8,41.37 65.01,41.37 U11.24 65.17,41.37 v66.23,41.37 | 63.8,41.37 63.34,41.82 C25.1 63.8,41.37 | 63.8,41.37 v62.88,40.45 56.78,40.45 v56.48,40.76 | v67.45,35.58 68.37,35.58 R44.2 | v67.76,32.07 67.76,31 | 42.46,17.29 42.31,17.13 41.85,17.13 U13.8 | 42.46,17.29 43.53,18.35 43.53,20.79 R50.2 43.68,20.94 45.81,23.08 46.88,23.08 | 46.88,23.08 47.18,22.77 47.18,21.55 46.42,20.79 46.42,20.49 R15.1 | v48.71,29.33 48.71,25.97 C15.2 | v46.88,23.38 46.88,23.08 | 18.38,31.77 15.79,31.77 9.24,38.32 8.63,38.32 8.47,38.47 | 18.38,31.77 v25.24,31.77 | 18.38,31.77 v18.38,29.48 | 8.47,38.47 8.47,34.05 8.78,33.75 12.74,33.75 22.65,23.84 22.65,23.69 27.83,18.51 28.9,18.51 29.2,18.2 v29.5,18.2 31.18,18.2 33.62,15.76 39.56,15.76 R52.2 39.72,15.61 39.87,15.46 42,15.46 C55.2 42.15,15.31 42.61,14.85 v42.61,14.24 | v42.92,16.83 42.46,17.29
  Top 0.525: C15.2 50.84,25.85 U$1.8
  Bottom 0.152: v62.88,40.45 62.73,40.3 62.73,39.23 U9.4 | v66.23,41.37 67.91,41.37 68.37,40.91 68.37,40.3 67.76,39.69 66.69,39.69 65.47,38.47 65.47,37.71 C18.1 65.47,37.56 v67.45,35.58 67.76,35.27 v67.76,32.07 | 48.71,35.73 v48.71,29.33 48.71,28.56 46.88,26.74 v46.88,23.38 | v56.48,40.76 53.74,40.76 48.71,35.73 | 48.71,35.73 v48.71,36.03 | v29.5,18.2 26.76,20.94 21.88,20.94 C20.1 | U7.4 34.69,32.68 33.31,32.68 C45.1 33.16,32.53 32.86,32.53 32.1,31.77 v25.24,31.77 | v18.38,29.48 18.38,27.34 L3.2 | v42.92,16.83 42.92,14.54 v42.61,14.24
  Bottom 0.386: L3.2 18.55,27 U6.4
CAM_NSS
  Top 0.152: ARDUCAM.1 76.75,30.09 75.99,29.33 75.99,27.34 R42.2 75.84,27.19 73.24,24.6 67.3,24.6 61.05,18.35 61.05,16.68 59.98,15.61 48.86,15.61 48.25,16.22 41.24,16.22 40.94,16.52 33.31,16.52 31.03,18.81 27.98,18.81 26.15,20.64 26.15,22.77 26.3,22.93 34.99,22.93 36.36,24.3 36.36,25.06 U12.13
DEPLOYMENT_SWITCH
  Bottom 0.152: U4.3 18.07,36.64 18.38,36.95 18.38,37.1 19.14,37.86 23.71,37.86 24.17,37.4 24.17,36.64 24.63,36.18 30.12,36.18 32.55,33.75 37.12,33.75 37.43,33.44 38.8,33.44 38.95,33.29 38.95,32.07 39.56,31.46 39.72,31.46 40.48,30.7 40.48,26.28 49.32,17.44 SL6.1
  Bottom 0.386: U4.3 18.05,34.9 R13.1
GND  (via drill 0.35)
  Top 0.152: J6.2 5.43,15 14.88,15 16.4,13.48 U5.10 16.55,13.48 20.97,13.48 U5.9 21.12,13.48 24.78,17.13 27.37,17.13 U5.7 | 41.24,11.95 42.15,12.87 | 42.15,12.87 43.68,14.39 43.68,15.31 C55.1 | 41.24,11.95 41.24,11.65 SL2.4 41.24,11.95 | U12.18 40.48,25.06 40.48,24.45 39.72,23.69 39.72,20.79 R51.2 39.72,20.64 37.12,20.64 34.99,18.51 J2.1 | 29,13.32 39.87,13.32 41.24,11.95 | 48.55,23.54 48.55,21.1 46.73,19.27 46.12,19.27 U13.4 | 48.55,23.54 48.55,24.14 C15.1 | v49.77,23.54 48.55,23.54 | 66.08,11.5 62.12,15.46 62.12,17.29 SL6.6 62.12,17.44 66.54,17.44 70.81,21.71 70.81,22.32 IC1.13 | 66.08,11.5 66.84,10.73 68.37,10.73 C56.1 | 66.08,11.5 64.86,10.28 63.34,10.28 58,4.94 57.55,4.94 J3.4 57.39,4.94 54.96,4.94 J3.6 54.8,4.94 52.36,4.94 J3.8 52.21,4.94 49.93,4.94 J3.10 49.77,4.94 49.77,7.23 46.73,10.28 44.75,10.28 42.15,12.87 | 71.57,34.05 68.67,34.05 67.91,33.29 67.6,33.29 R11.2 | 71.57,34.05 72.33,33.29 R7.2 72.48,33.14 72.48,32.68 73.24,31.92 73.24,28.87 72.48,28.11 70.65,28.11 | 70.65,28.11 69.59,29.17 67.3,29.17 C6.1 | 70.65,28.11 70.65,27.04 U2.4 | 70.96,41.37 70.96,41.82 U11.2 70.81,41.98 68.52,41.98 66.54,43.96 | 66.54,43.96 66.54,44.57 70.35,48.38 70.81,48.38 U11.12 | 66.54,43.96 65.93,43.35 65.17,43.35 U11.21 65.01,43.35 63.49,43.35 63.34,43.5 C25.2 63.19,43.5 62.73,43.04 62.73,42.89 61.2,41.37 49.32,41.37 48.1,40.15 J16.1 | 73.09,39.84 73.7,39.84 74.01,40.15 76.75,40.15 ARDUCAM.5 | 73.09,39.84 72.48,40.45 72.48,41.06 72.18,41.37 70.96,41.37 | 70.96,41.37 U11.1 | 71.57,34.05 71.57,38.32 73.09,39.84 | 81.6,43.96 85.59,43.96 86.96,45.33 89.09,45.33 U3.9 89.25,45.48 90.31,46.55 92.6,46.55 93.67,45.48 U3.10 93.82,45.33 95.8,45.33 97.17,43.96 104.49,43.96 104.94,44.41 J5.2
  Top 0.152: J5.1 105.1,41.52 105.1,40.6 104.03,39.54 104.03,34.51 105.1,33.44 SL4.4 | U$1.7 51.3,27.34 51.3,28.87 U$1.6 51.15,29.02 50.23,29.94 | U12.28 45.51,30.7 46.12,30.7 46.88,29.94 47.34,29.94 C5.2 47.49,29.94 50.23,29.94 | 50.23,29.94 50.38,29.94 51.15,30.7 U$1.5 51.3,30.85 51.3,32.53 U$1.4 51.3,32.68 51.6,32.68 52.52,33.59 52.52,35.27 51.6,36.18 51.3,36.18 U$1.2 51.15,36.34 49.32,36.34 48.55,37.1 48.1,37.1 J16.2 | U1.18 40.17,43.8 41.39,43.8 42.15,43.04 C9.2 | C9.2 42.15,42.89 42.15,41.67 C10.2 42.15,41.52 42.76,41.52 44.9,39.38 45.1,39.3 | 41.09,47.46 41.39,47.77 SL3.4 | 41.09,47.46 39.87,46.24 36.36,46.24 34.38,44.26 34.38,38.93 C11.2 | J1.1 53.58,55.54 53.28,55.54 46.42,48.68 42.31,48.68 41.55,47.92 SL3.4 | 41.09,47.46 43.07,45.48 43.07,43.8 42.31,43.04 C9.2 | 41.09,47.46 SL3.4 | U1.9 37.73,40.45 37.73,38.77 C1.2 37.73,38.62 38.04,38.62 38.8,37.86 40.17,37.86 | 40.17,39.38 40.02,39.54 39.26,39.54 38.8,39.99 38.8,40.45 U1.11 | 40.17,37.86 40.17,37.56 39.72,37.1 39.72,36.64 U12.39 | 40.17,37.86 40.17,39.38 | v40.33,39.54 40.17,39.38 | C26.2 6.19,43.2 6.19,41.82 C23.2 6.34,41.67 6.64,41.67 7.41,40.91 7.41,37.71 6.64,36.95 5.12,36.95 | U14.11 4.82,40.45 4.36,40.45 4.21,40.3 4.21,39.84 4.51,39.54 4.82,39.54 U14.9 4.97,39.54 4.97,38.47 5.12,38.32 5.12,36.95 | 5.12,36.95 5.12,33.44 SL1.4 | C4.2 30.57,31.46 30.88,31.46 31.64,30.7 33.92,30.7 U12.6 | Y2.2 31.18,28.41 30.88,28.41 30.12,29.17 30.12,31.16 30.42,31.46 C4.2 | v29.5,32.53 30.42,31.61 C4.2
  Top 0.525: U5.7 29,15.88 29,13.32 29,12.25 C14.1 | J5.2 107.22,44.48 108,43.7 108,42.4 107.33,41.73 J5.1 | J6.1 2.88,17.67 2.2,17 2.2,15.1 2.38,14.93 J6.2 | J16.1 45.77,39.98 45.1,39.3 45.1,37.9 45.77,37.23 J16.2 | C13.1 82.2,48.6 81.6,48 81.6,43.96 81.6,42.62 U3.7
  Bottom 0.152: SL2.4 41.09,11.65 41.09,12.26 34.99,18.35 J2.1 34.84,18.51 31.18,22.16 23.41,22.16 | U9.3 63.49,39.08 63.49,38.47 63.64,38.32 63.64,37.71 C18.2 63.64,37.56 55.57,37.56 52.82,34.81 C16.2 52.82,34.66 52.82,33.44 55.26,31 55.26,30.55 U8.2 55.41,30.39 55.41,28.72 56.94,27.19 | 54.96,25.21 53.89,25.21 53.13,25.97 52.67,25.97 D3.C 52.52,25.97 50.08,23.54 v49.77,23.54 | 56.94,27.19 58.31,28.56 58.31,28.87 C17.2 | 56.94,27.19 54.96,25.21 | 54.96,25.21 54.96,24.45 61.97,17.44 SL6.6 | 96.71,41.82 94.73,43.8 C8.- | 96.71,41.82 97.32,41.21 97.32,39.99 D5.C 97.48,39.84 104.49,32.83 104.64,32.83 | 96.71,41.82 95.04,40.15 95.04,38.93 94.89,38.77 94.89,37.56 C7.- 94.73,37.4 94.43,37.4 93.67,36.64 92.6,36.64 91.68,37.56 | C22.2 89.25,43.65 89.25,42.13 91.68,39.69 91.68,39.38 U10.2 91.68,39.23 91.68,37.56 | 91.68,37.56 91.08,36.95 90.01,36.95 89.25,37.71 88.94,37.71 C21.2 88.79,37.86 87.87,38.77 86.2,38.77 D9.C 86.05,38.93 85.28,38.93 84.06,40.15 76.9,40.15 ARDUCAM.5 | 104.64,32.83 105.1,33.29 SL4.4 104.64,32.83 | 104.64,32.83 103.42,31.61 103.42,22.32 104.03,21.71 105.7,21.71 106.77,20.64 106.77,17.13 105.25,15.61 105.25,15.15 SL5.4 | D1.A 37.89,34.36 37.58,34.36 36.82,35.12 U7.8 | U7.8 36.67,35.27 36.06,35.27 U7.7 35.91,35.12 35.91,34.51 35.75,34.36 33.77,34.36 31.18,36.95 25.09,36.95 D2.C 24.93,37.1 24.93,37.71 23.87,38.77 C2.- 23.71,38.93 22.19,40.45 22.19,40.91 C12.2 22.04,41.06 21.28,41.82 17.77,41.82 16.86,40.91 C19.2 16.55,40.76 16.55,35.73 17.01,35.27 17.01,34.05 17.92,33.14 | U7.8 36.82,35.27 40.33,38.77 v40.33,39.54 41.39,40.6 41.39,47.77 SL3.4
  Bottom 0.152: 23.41,22.16 23.41,23.38 22.65,24.14 22.65,24.45 C52.2 | 23.41,22.16 23.1,21.86 20.97,21.86 20.21,21.1 C20.2 | U7.3 35.3,32.68 35.3,33.29 35.14,33.44 32.71,33.44 31.94,32.68 31.64,32.68 C45.2 31.49,32.68 29.5,32.68 | 17.92,33.14 17.92,33.29 18.99,34.36 18.99,36.49 U4.2 19.14,36.64 19.14,36.95 19.75,37.56 22.19,37.56 22.34,37.4 22.34,34.81 C3.- 22.5,34.66 24.48,32.68 29.5,32.68 | 17.92,33.14 17.92,32.83 D8.C | U6.2 19.6,23.23 19.6,23.54 20.97,24.91 20.97,29.63 17.92,32.68 D8.C | 29.5,32.68 v29.5,32.53 | SL1.4 5.12,33.29 14.11,33.29 15.48,31.92 17.01,31.92 17.77,32.68 D8.C | 17.92,33.14 D8.C
  Bottom 0.386: U6.2 19.5,21.55 C20.2 20.05,18.45 19.4,17.8 D4.C
  pour Top: 0.7,49.5 1.2,50 9.5,50 46,50 46.6,50.6 46.6,58.3 46.9,58.6 63,58.6 63.5,58.1 63.5,50.4 63.9,50 109,50 109.5,49.5 109.5,36.6 109,36.1 107.8,36.1 107.3,35.6 107.3,23.6 107.9,23 109.4,23 109.4,9.8 108.8,9.2 63.8,9.2 63.4,8.8 63.4,1.1 62.9,0.6 47.2,0.6 46.5,1.3 46.5,8.8 46.1,9.2 1.1,9.2 0.5,9.8 0.5,22.6 1,23.1 2.2,23.1 2.6,23.5 2.6,36 2.2,36.4 0.6,36.4 0.6,49.4
  pour Route2: 0.7,49 1.7,50 46.3,50 46.7,50.4 46.7,52.1 46.7,58.3 47,58.6 63.1,58.6 63.4,58.3 63.4,50.4 63.9,49.9 109,49.9 109.4,49.5 109.4,36.6 108.9,36.1 107.6,36.1 107.3,35.8 107.3,23.5 107.9,22.9 109.4,22.9 109.5,22.8 109.5,9.5 109.2,9.2 63.8,9.2 63.4,8.8 63.3,8.7 63.3,0.5 46.8,0.5 46.8,8.6 46,9.4 1,9.4 0.5,9.9 0.5,22.4 1.2,23.1 2.3,23.1 2.7,23.5 2.7,35.9 2.3,36.3 0.6,36.3 0.6,48.9
  pour Bottom: 0.6,49.3 1.3,50 1.8,50 46.1,50 46.6,50.5 46.6,58.2 47,58.6 63,58.6 63.4,58.2 63.4,50.4 63.9,49.9 109.1,49.9 109.4,49.6 109.4,36.4 109.1,36.1 107.8,36.1 107.4,35.7 107.4,35.2 107.4,23.4 107.9,22.9 109.3,22.9 109.4,23 109.4,9.7 108.8,9.1 63.8,9.1 63.3,8.6 63.3,0.8 63,0.5 47,0.5 46.6,0.9 46.6,8.7 46.1,9.2 1.3,9.2 0.6,9.9 0.6,22.4 1.1,22.9 2.1,22.9 2.7,23.5 2.7,35.9 2.2,36.4 0.8,36.4 0.7,36.3 0.7,49.2
LORA_BUSY  (via drill 0.35)
  Top 0.152: v38.95,35.27 38.95,36.49 U12.40 | v61.05,26.89 63.03,28.87 64.25,28.87 U$1.11
  Route15 0.152: v47.95,28.72 59.22,28.72 v61.05,26.89
  Bottom 0.152: v38.95,35.27 39.87,35.27 40.33,35.73 40.94,35.73 42,34.66 42,33.9 47.18,28.72 v47.95,28.72
LORA_CS  (via drill 0.35)
  Top 0.152: v66.23,32.98 65.93,33.29 65.93,36.79 66.69,37.56 66.69,38.47 D6.C | v61.51,34.2 61.51,35.42 63.95,37.86 64.25,37.86 U$1.16 | v36.82,26.43 37.28,25.97 37.28,25.21 U12.14
  Route15 0.152: v36.82,26.43 36.82,27.04 41.09,31.31 v60.29,31.31
  Bottom 0.152: v66.23,32.98 63.19,32.98 62.58,33.59 | 62.58,33.59 61.97,34.2 v61.51,34.2 | 62.58,33.59 v60.29,31.31
LORA_DIO1  (via drill 0.35)
  Top 0.152: v42.76,35.27 42,34.51 38.8,34.51 38.19,35.12 38.19,36.49 U12.41 | v51.3,39.23 65.17,39.23 65.62,38.77 65.62,28.26 64.71,27.34 64.41,27.34 U$1.10
  Bottom 0.152: v42.76,35.27 47.03,35.27 50.99,39.23 v51.3,39.23
LORA_DIO2  (via drill 0.35)
  Top 0.152: v35.6,37.86 36.52,37.86 37.28,37.1 37.28,36.64 U12.42 | v62.42,27.34 62.42,27.04 63.95,25.52 64.25,25.52 U$1.9
  Route15 0.152: v35.6,37.86 56.63,37.86 v60.29,34.2
  Bottom 0.152: v60.29,34.2 60.29,32.22 59.68,31.61 59.68,30.09 v62.42,27.34
LORA_RST  (via drill 0.35)
  Top 0.152: v45.05,24.14 44.9,23.99 43.37,23.99 42.92,24.45 42.92,25.06 U12.21 | v57.55,24.75 58,24.75 63.95,30.7 64.25,30.7 U$1.12
  Route2 0.152: v45.05,24.14 45.51,24.14 46.12,24.75 v57.55,24.75
LORA_SW
  Top 0.152: U12.22 43.68,25.21 43.68,26.89 40.48,30.09 40.48,31.16 44.75,35.42 49.93,35.42 50.84,34.51 51.15,34.51 U$1.3
MISO_UC  (via drill 0.35)
  Top 0.152: v62.73,32.53 64.25,32.53 U$1.13 | v32.55,34.66 33.16,34.05 33.92,34.05 U12.2
  Route15 0.152: ARDUCAM.3 76.9,35.12 77.97,34.05 77.97,32.37 77.05,31.46 66.54,31.46 65.47,32.53 v62.73,32.53 58.31,32.53 58.16,32.37 32.55,32.37 | 32.55,32.37 32.55,25.82 46.27,12.11 46.27,10.73 48.86,8.14 48.86,3.27 49.77,2.35 J3.9 | 32.55,32.37 v32.55,34.66
MOSI_UC  (via drill 0.35)
  Top 0.152: v33.92,35.58 33.92,34.81 U12.1 | v62.73,34.36 64.25,34.36 U$1.14
  Route15 0.152: v33.92,35.58 37.73,35.58 39.72,33.59 62.73,33.59 | 62.73,33.59 75.84,33.59 76.75,32.68 ARDUCAM.2 | 62.73,33.59 v62.73,34.36
  Bottom 0.152: J3.1 59.83,2.35 59.83,3.57 58.92,4.48 58.92,6.92 75.22,23.23 75.22,31 76.75,32.53 ARDUCAM.2
N$1
  Bottom 0.152: D5.A 97.32,38.32 97.02,38.32 95.95,39.38 R19.1
N$2
  Bottom 0.152: D8.A 16.09,32.83 16.09,34.66 R13.2
N$4
  Top 0.152: R7.1 70.65,33.14 70.65,32.53 70.04,31.92 70.04,31.46 U2.6
N$5
  Bottom 0.152: D4.A 16.25,17.9 16.25,19.88 R17.1
N$6
  Bottom 0.152: D3.A 54.35,26.13 53.89,26.13 52.52,27.5 R2.1
N$7
  Bottom 0.152: D2.A 24.93,35.42 24.63,35.42 R1.1
N$8
  Bottom 0.386: R18.2 17.85,22.4 U6.3 18.55,20.5 R17.2
N$9
  Bottom 0.386: R8.2 54.45,29.8 U8.3 54.45,27.8 R2.2
N$10
  Bottom 0.152: D1.C 39.72,34.2 39.72,32.83 R6.1
N$11
  Top 0.152: D6.A 68.52,38.47 68.52,37.25 R44.1
N$14
  Bottom 0.386: L1.1 56.45,33.2 U8.5
N$15
  Bottom 0.152: C22.1 90.92,43.65 90.92,41.98 U10.4
N$16
  Top 0.152: U12.7 33.92,29.94 31.64,29.94 31.33,29.63 Y2.1
N$18
  Bottom 0.152: D9.A 86.2,40.6 87.27,40.6 87.72,40.15 R20.2
N$21
  Top 0.152: C24.1 U14.8
N$26
  Top 0.152: U14.12 4.97,41.06 5.58,41.06 5.73,40.91 6.95,40.91 7.1,40.76 7.1,38.77 6.04,37.71 C24.2
N$28
  Top 0.152: C23.1 U14.10
N$29
  Bottom 0.152: L3.1 16.55,27.19 16.55,26.43 18.23,24.75 19.45,24.75 20.36,25.67 U6.5
N$30
  Bottom 0.386: C19.1 18.25,39.3 U4.4
N$31
  Top 0.152: C9.1 41.53,45.42 39.14,45.42 39.12,45.4 39,45.4 38.78,45.18 U1.20
N$32
  Top 0.152: U1.10 38.28,39.92 39.35,38.85 C1.1
N$33
  Top 0.152: U12.8 33.92,29.17 33.31,29.17 32.4,28.26 32.4,27.95 31.79,27.34 31.33,27.34 Y2.3
N$34
  Top 0.152: R53.1 41.05,41.15 40.9,41.3 U1.13
N$35
  Top 0.152: R12.1 72.48,31.31 70.81,31.31 U2.5
N$36
  Top 0.152: C5.1 47.34,31.61 45.51,31.61 U12.29
N$37
  Top 0.152: R11.1 69.28,33.14 69.28,31.46 U2.7
N$54
  Top 0.152: R14.2 69.89,25.52 69.89,26.89 U2.3
N$55
  Top 0.152: R50.1 41.85,20.79 41.85,19.27 U13.5
N$56
  Top 0.152: R51.1 39.87,18.81 40.78,18.81 41.09,18.51 41.7,18.51 U13.6
N$57
  Top 0.152: R52.1 39.72,17.44 40.78,17.44 41.09,17.74 41.7,17.74 U13.7
N$58
  Top 0.152: R15.2 46.27,22.01 46.27,21.71 45.2,20.64 45.2,18.81 45.51,18.51 45.96,18.51 U13.3
PAYLOAD_OUT
  Bottom 0.152: U9.2 64.1,39.08 64.1,38.62 64.56,38.17 64.56,36.95 66.54,34.96 66.84,34.96 67.15,34.66 67.15,31.77 67.45,31.46 68.06,31.46 68.37,31.77 68.37,38.47 R9.1
PAYLOAD_REG_EN  (via drill 0.35)
  Top 0.152: v42.61,34.2 38.19,34.2 36.52,35.88 36.52,36.49 U12.43
  Route2 0.152: v49.62,28.11 47.64,28.11 42.61,33.14 v42.61,34.2
  Bottom 0.152: v49.62,28.11 50.69,29.17 52.52,29.17 R8.1
RECEIVER_PD
  Top 0.152: U12.16 38.8,25.06 38.8,24.3 38.34,23.84 36.36,23.84 34.84,22.32 28.29,22.32 27.68,21.71 U5.6
RECEIVER_RX
  Top 0.152: U12.11 33.92,26.74 33.31,26.74 31.03,24.45 22.5,24.45 11.98,34.96 10,34.96 U5.16
RECEIVER_TX
  Top 0.152: U12.12 35.75,25.21 35.75,26.89 38.34,29.48 38.34,32.07 32.1,38.32 11.06,38.32 10,39.38 U5.17
REG_ARDU
  Top 0.152: R42.1 77.66,27.34 77.66,28.72 78.58,29.63 78.58,41.06 76.9,42.74 ARDUCAM.6
  Bottom 0.152: 88.33,43.2 88.64,42.89 88.64,39.38 88.79,39.23 89.09,39.23 90.47,37.86 C21.1 | 88.33,43.2 88.33,44.41 88.48,44.57 92.29,44.57 92.9,43.96 C8.+ 92.9,43.8 92.75,43.65 92.75,41.98 U10.5 | 88.33,43.2 77.21,43.2 76.9,42.89 ARDUCAM.6
REG_ARDU_EN
  Bottom 0.152: R20.1 89.55,39.99 90.16,39.99 90.77,39.38 U10.3
REG_BUS_EN  (via drill 0.35)
  Top 0.152: v45.2,25.82 45.2,26.58 45.36,26.74 U12.23
  Route2 0.152: v32.4,20.03 37.89,25.52 44.9,25.52 v45.2,25.82
  Bottom 0.152: v32.4,20.03 29.35,16.98 17.31,16.98 17.01,17.29 17.01,18.2 17.16,18.35 17.16,20.49 15.79,21.86 15.79,22.32 R18.1
REG_PAYLOAD  (via drill 0.35)
  Top 0.152: v71.87,40.76 71.72,40.6 v67.76,40.6 67.76,38.17 66.54,36.95 v66.54,34.36 | v27.98,15.76 25.85,13.63 U5.8 | v83,45.33 84.37,45.33 U3.8
  Top 0.525: U5.8 25.7,10.95 C14.2 | U3.8 84.85,45.77 C13.2
  Route2 0.152: v27.98,15.76 29.35,15.76 33.62,20.03 40.02,20.03 45.2,25.21 57.09,25.21 66.23,34.36 v66.54,34.36
  Bottom 0.152: C16.1 54.5,34.81 55.26,35.58 57.24,35.58 58,34.81 L1.2 58.16,34.81 62.27,34.81 62.42,34.96 65.93,34.96 v66.54,34.36 | 64.71,40.6 64.71,41.67 U9.8 | 64.71,40.6 64.71,39.23 U9.1 | v67.76,40.6 64.71,40.6 | R9.2 68.52,44.11 v71.87,40.76 74.92,43.8 77.51,43.8 79.03,45.33 v83,45.33
  Bottom 0.386: C16.1 U8.4
RESET_1  (via drill 0.35)
  Top 0.152: R10.1 32.1,33.14 32.55,33.14 33.16,32.53 33.92,32.53 U12.4 34.08,32.37 34.53,32.37 35.3,31.61 v37.43,31.61 | v41.09,30.39 42.15,29.33 45.36,29.33 U12.26
  Route2 0.152: v41.09,30.39 38.65,30.39 v37.43,31.61
  Route15 0.152: v41.09,30.39 38.8,28.11 38.8,25.97 46.57,18.2 46.57,11.65 50.84,7.38 50.84,4.48 51.91,3.42 52.67,3.42 53.74,2.35 54.8,2.35 J3.5
RTC_INT  (via drill 0.35)
  Top 0.152: R16.1 71.72,10.73 70.65,11.8 70.5,11.8 69.74,12.56 69.74,13.17 IC1.3 69.59,13.32 69.43,13.48 v69.43,14.85 | v47.95,23.08 47.95,23.23 47.18,23.99 46.12,23.99 44.44,25.67 44.44,27.95 44.9,28.41 45.36,28.41 U12.25
  Route2 0.152: v47.95,23.08 49.32,23.08 54.04,18.35 65.93,18.35 v69.43,14.85
RX_MICIN  (via drill 0.35)
  Top 0.152: v34.38,45.18 26.3,45.18 25.09,43.96 10,43.96 U5.18 | v80.71,28.11 80.71,25.82 82.54,23.99 U3.3
  Route2 0.152: v34.38,45.18 39.41,45.18 44.44,40.15 58.16,40.15 62.12,44.11 63.64,44.11 63.95,44.41 63.95,45.02 63.64,45.33 63.34,45.33 63.03,45.63 63.03,47.16 63.64,47.77 66.39,47.77 69.89,44.26 72.33,44.26 75.84,40.76 75.84,39.99 77.05,38.77 77.21,38.77 80.71,35.27 v80.71,28.11
RX_PTT  (via drill 0.35)
  Top 0.152: v31.03,25.67 30.57,26.13 27.68,26.13 U5.5 | v64.71,15.61 68.82,15.61 68.98,15.76 81.78,15.76 82.54,15 U3.1
  Route2 0.152: v38.65,18.81 46.42,18.81 49.47,15.76 64.56,15.76 v64.71,15.61
  Bottom 0.152: v31.03,25.67 31.94,25.67 38.65,18.96 v38.65,18.81
SCK_UC  (via drill 0.35)
  Top 0.152: v62.12,31.77 62.12,34.66 63.64,36.18 64.25,36.18 U$1.15 | v35.45,27.5 38.04,30.09 38.04,31.92 36.82,33.14 34.08,33.14 U12.3
  Bottom 0.152: v62.12,31.77 62.12,28.56 67.76,22.93 67.76,20.34 68.06,20.03 68.67,20.03 | 68.67,20.03 74.92,26.28 74.92,35.88 76.75,37.71 ARDUCAM.4 | v35.45,27.5 35.45,25.21 46.27,14.39 46.27,10.73 51.15,5.86 | 51.15,5.86 51.3,5.7 51.3,3.27 52.21,2.35 J3.7 | 68.67,20.03 68.67,17.13 57.39,5.86 51.15,5.86
SCL_BOTTOM  (via drill 0.35)
  Top 0.152: v60.44,49.6 60.9,49.6 62.58,47.92 62.58,47.61 63.64,46.55 65.01,46.55 U11.16
  Route15 0.152: v60.44,49.6 62.73,49.6 64.25,48.07 65.47,48.07 72.79,40.76 72.79,40.15 76.75,36.18 77.36,36.18 78.27,35.27 78.27,32.22 77.21,31.16 73.4,31.16 59.53,17.29 SL6.5
SCL_BUS  (via drill 0.35)
  Top 0.152: v69.59,28.26 69.43,28.11 69.43,27.04 U2.2 | v68.98,23.99 68.06,23.99 67.15,23.08 67.15,22.47 IC1.16 | v62.12,43.2 62.42,43.5 62.42,44.72 63.03,45.33 65.01,45.33 U11.18 | v16.7,45.18 4.36,45.18 2.23,43.04 2.23,41.06 U14.1 | U1.23 37.12,44.72 37.12,45.18 36.82,45.48 36.06,45.48 35.14,44.57 35.14,38.32 34.69,37.86 v34.69,36.64 34.69,36.18 38.65,32.22 38.65,29.33 38.19,28.87 v38.19,26.58 | v44.44,19.42 44.44,18.81 45.36,17.9 45.96,17.9 U13.2
  Route2 0.152: v62.12,43.2 61.66,43.2 56.78,38.32 36.97,38.32 35.3,36.64 v34.69,36.64
  Route15 0.152: v69.59,35.88 69.59,40.3 66.69,43.2 v62.12,43.2
  Bottom 0.152: v68.98,23.99 69.59,24.6 v69.59,28.26 v69.59,35.88 | v62.12,43.2 62.12,42.28 62.58,41.82 U9.5 | v16.7,45.18 23.41,45.18 33.62,34.96 34.53,34.96 34.69,35.12 U7.5 34.69,35.27 v34.69,36.64 | v44.44,19.42 44.44,20.03 38.19,26.28 v38.19,26.58
SCL_CAM
  Top 0.152: ARDUCAM.8 75.78,49.01 66.5,49.01 66.1,48.61 66.1,44.1 65.92,43.93 U11.20
SCL_EAST  (via drill 0.35)
  Top 0.152: v69.89,46.55 70.81,46.55 U11.9
  Route15 0.152: v66.84,45.79 66.23,45.79 64.25,47.77 62.73,47.77 61.66,48.83 44.44,48.83 42.46,46.85 39.87,46.85 38.95,47.77 SL3.3
  Bottom 0.152: v69.89,46.55 69.89,45.79 69.43,45.33 67.3,45.33 v66.84,45.79
SCL_NORTH  (via drill 0.35)
  Top 0.152: v72.03,43.65 71.87,43.8 70.96,43.8 U11.5
  Route2 0.152: v72.03,43.65 68.98,40.6 v68.98,39.99
  Route15 0.152: v68.98,39.99 66.54,39.99 65.32,38.77 51.76,38.77 51.45,38.47 12.59,38.47 5.12,31 SL1.3
SCL_SOUTH  (via drill 0.35)
  Top 0.152: v73.4,47.77 70.96,47.77 U11.11 | v90.62,45.94 93.36,43.2 93.97,43.2 98.69,38.47 98.69,36.18 100.83,34.05 102.05,34.05 105.1,31 SL4.3
  Bottom 0.152: v73.4,47.77 74.92,47.77 76.29,46.4 90.16,46.4 v90.62,45.94
SCL_TOP  (via drill 0.35)
  Top 0.152: v59.53,49.6 60.14,50.2 60.75,50.2 63.03,47.92 65.01,47.92 U11.14
  Route2 0.152: v59.53,49.6 60.29,48.83 74.62,48.83 77.05,46.4 77.21,46.4 105.1,18.51 105.1,17.74 SL5.3
SCL_UC  (via drill 0.35)
  Top 0.152: v65.47,39.84 66.08,39.84 67.15,40.91 67.15,41.82 66.39,42.59 65.17,42.59 U11.22 | v41.85,26.43 41.39,25.97 41.39,25.21 U12.19 41.24,25.06 41.24,24.45 40.63,23.84 40.63,23.23 R4.2
  Route2 0.152: v65.47,39.84 63.8,39.84 50.69,26.74 42.92,26.74 42.61,26.43 v41.85,26.43
SCL_WEST  (via drill 0.35)
  Top 0.152: v66.39,16.83 67.76,18.2 68.52,18.2 71.41,21.1 71.41,23.54 71.72,23.84 75.68,23.84 78.43,26.58 78.43,26.74 81.17,29.48 81.93,29.48 84.06,31.61 84.06,38.32 83.91,38.47 82.69,38.47 80.71,40.45 80.71,41.06 77.97,43.8 76.29,43.8 74.92,45.18 70.96,45.18 U11.7
  Route2 0.152: v66.39,16.83 66.39,16.37 64.86,14.85 64.56,14.85 62.73,13.02 62.73,11.65 61.66,10.58 39.72,10.58 38.8,11.5 SL2.3
SDA_BOTTOM  (via drill 0.35)
  Top 0.152: v63.95,47.16 65.01,47.16 U11.15 | v59.68,38.17 59.68,27.95 56.94,25.21 56.94,17.44 SL6.4
  Route2 0.152: v63.95,47.16 63.95,46.55 64.25,46.24 64.25,42.74 v59.68,38.17
SDA_BUS  (via drill 0.35)
  Top 0.152: v29.2,41.37 10,41.37 7.1,44.26 3.9,44.26 2.84,43.2 2.84,41.67 U14.16 | v36.06,44.57 36.67,44.57 U1.24 | v63.64,45.94 65.01,45.94 U11.17 | v48.55,19.12 46.57,17.13 46.12,17.13 U13.1 | v68.67,28.26 68.67,27.04 U2.1 | v68.37,20.64 68.37,22.32 IC1.15
  Route15 0.152: v36.06,44.57 40.02,44.57 44.44,40.15 58,40.15 62.73,44.87 62.73,45.02 v63.64,45.94
  Bottom 0.152: v29.2,41.37 30.88,41.37 31.79,40.45 | 31.79,40.45 35.3,36.95 35.3,35.27 U7.6 | v36.06,44.57 31.94,40.45 31.79,40.45 | v63.64,45.94 63.64,45.33 63.95,45.02 63.95,43.8 | 63.95,41.82 63.95,42.74 | 63.95,42.74 63.95,43.8 | v48.55,19.12 48.55,27.95 51.91,31.31 51.91,35.27 60.44,43.8 63.95,43.8 | 63.95,42.74 64.86,42.74 65.32,42.28 67.6,42.28 70.35,39.54 70.35,37.56 68.67,35.88 v68.67,28.26 68.37,27.95 v68.37,20.64 | 63.95,41.82 63.49,41.82 U9.6 | 63.95,41.82 U9.7
SDA_CAM  (via drill 0.35)
  Top 0.152: v63.34,44.72 65.01,44.72 U11.19
  Route2 0.152: v63.34,44.72 62.73,45.33 62.73,47.31 63.49,48.07 72.18,48.07 74.77,45.48 76.75,45.48 ARDUCAM.7
SDA_EAST  (via drill 0.35)
  Top 0.152: v69.13,45.94 70.81,45.94 U11.8
  Route15 0.152: v42.76,48.07 41.85,48.99 37.43,48.99 36.36,47.92 SL3.2
  Bottom 0.152: v69.13,45.94 67.6,45.94 64.86,48.68 63.19,48.68 60.44,51.42 49.16,51.42 45.81,48.07 v42.76,48.07
SDA_NORTH  (via drill 0.35)
  Top 0.152: v72.18,42.28 72.18,42.43 71.41,43.2 70.96,43.2 U11.4
  Route2 0.152: v72.18,42.28 63.34,33.44 58.31,33.44 v57.85,32.98
  Route15 0.152: v57.85,32.98 55.57,32.98 55.26,33.29 34.84,33.29 32.86,35.27 11.98,35.27 5.12,28.41 SL1.2
SDA_SOUTH
  Top 0.152: U11.10 70.96,47.16 75.53,47.16 76.29,46.4 77.97,46.4 81.02,43.35 81.02,40.6 82.84,38.77 84.06,38.77 87.57,35.27 87.57,34.96 93.06,29.48 104.03,29.48 105.1,28.41 SL4.2
SDA_TOP  (via drill 0.35)
  Top 0.152: v60.14,50.82 60.59,50.82 62.88,48.53 65.01,48.53 U11.13
  Bottom 0.152: v60.14,50.82 63.34,47.61 63.34,46.85 63.64,46.55 63.95,46.55 66.54,43.96 66.54,43.04 67,42.59 69.13,42.59 72.94,38.77 84.98,38.77 103.57,20.18 105.1,20.18 SL5.2
SDA_UC  (via drill 0.35)
  Top 0.152: v63.8,40.45 66.23,40.45 66.84,41.06 66.84,41.67 66.54,41.98 65.17,41.98 U11.23 | v42.46,27.19 42.46,25.97 42.15,25.67 42.15,25.21 U12.20 42,25.06 42,23.23 R3.2
  Route2 0.152: v63.8,40.45 50.54,27.19 v42.46,27.19
SDA_WEST  (via drill 0.35)
  Top 0.152: v73.4,40.45 73.4,43.2 72.03,44.57 70.96,44.57 U11.6
  Route2 0.152: v73.4,40.45 73.4,16.52 67.15,10.28 37.43,10.28 36.21,11.5 SL2.2
TRANSMITTER_PD  (via drill 0.35)
  Top 0.152: v39.41,26.43 38.95,26.43 38.19,25.67 38.19,25.21 U12.15 | v79.19,30.55 79.19,33.75 82.54,37.1 U3.6
  Route15 0.152: v39.41,26.43 39.41,25.82 49.01,16.22 64.86,16.22 v79.19,30.55
TRANSMITTER_RX  (via drill 0.35)
  Top 0.152: v35.3,28.41 34.08,28.41 U12.9 | v72.33,16.83 93.21,16.83 100.22,23.84 U3.16
  Route2 0.152: v64.86,14.24 69.74,14.24 v72.33,16.83
  Bottom 0.152: v35.3,28.41 35.75,28.41 37.58,26.58 37.58,23.84 46.57,14.85 46.57,11.65 47.64,10.58 61.66,10.58 64.86,13.78 v64.86,14.24
TRANSMITTER_TX  (via drill 0.35)
  Top 0.152: v31.94,26.28 33.16,27.5 33.92,27.5 U12.10 | v43.07,12.87 45.36,12.87 47.64,10.58 64.25,10.58 v64.86,11.19 | v98.24,18.66 99.61,18.66 100.22,19.27 U3.17
  Bottom 0.152: v31.94,26.28 38.8,19.42 38.95,19.42 42,16.37 42,13.93 v43.07,12.87 | v64.86,11.19 90.77,11.19 v98.24,18.66
TX_MICIN  (via drill 0.35)
  Top 0.152: v63.34,15.15 64.41,16.22 83.91,16.22 85.13,15 100.22,15 U3.18 | v25.85,25.06 25.85,33.29 27.52,34.96 U5.3
  Route2 0.152: v63.34,15.15 61.97,15.15 61.66,15.46 28.59,15.46 28.29,15.15 27.68,15.15 25.85,16.98 v25.85,25.06
TX_PTT  (via drill 0.35)
  Top 0.152: v79.95,33.59 80.71,32.83 82.54,32.83 U3.5 | v33.92,37.4 29.81,41.52 29.81,41.67 27.68,43.8 U5.1
  Route2 0.152: v79.95,33.59 76.9,36.64 76.6,36.64 74.01,39.23 74.01,40.76 73.7,41.06 73.09,41.06 68.22,36.18 66.54,36.18 63.49,33.14 58.92,33.14 52.21,26.43 43.07,26.43 42.46,25.82 40.94,25.82 36.36,30.39 35.6,30.39 34.53,31.46 34.53,35.88 33.92,36.49 v33.92,37.4
VIN-_SYS
  Bottom 0.152: 21.28,29.48 21.28,34.2 20.82,34.66 C3.+ | 21.28,29.48 21.28,22.75 | R6.2 38.04,32.83 37.58,32.83 36.97,33.44 36.36,33.44 36.06,33.14 36.06,32.68 U7.2 35.91,32.53 35.91,31.92 33.62,29.63 33.16,29.63 R36.1 33.01,29.48 21.28,29.48
  Bottom 0.386: U6.1 20.8,22.75 21.28,22.75 C52.1 | R1.2 20.25,36.8 U4.1 19.95,35.6 C3.+
VIO
  Top 0.152: U1.8 37.24,40.09 C11.1
VOUT_REG_UC  (via drill 0.35)
  Top 0.152: 68.37,12.41 70.04,10.73 C56.2 | 68.37,12.41 68.37,13.17 IC1.2 | R16.2 73.55,10.73 73.09,10.73 72.03,11.8 71.72,11.8 71.41,12.11 71.41,14.39 70.35,15.46 69.13,15.46 68.37,14.7 68.37,13.32 IC1.2 | v66.08,12.41 66.69,11.8 67.76,11.8 68.37,12.41 | 68.37,12.41 IC1.2 | R4.1 38.95,23.23 38.95,23.69 39.56,24.3 39.56,25.06 U12.17 39.72,25.21 39.72,25.67 v41.09,27.04 | v44.9,23.23 43.83,23.23 R3.1 | v44.14,29.94 45.36,29.94 U12.27 | v40.63,35.12 40.63,36.49 U12.38 | 32.4,31.61 30.88,33.14 R10.2 30.72,33.29 30.72,34.51 27.52,37.71 v18.07,37.71 | 32.4,31.61 33.92,31.61 U12.5 34.08,31.46 34.69,31.46 35.14,31 v35.91,31 | 32.4,31.61 C4.1
  Route2 0.152: v40.63,35.12 40.02,35.12 v35.91,31 | v66.08,12.41 68.82,12.41 72.94,16.52 72.94,17.13 72.03,18.05 70.04,18.05 63.95,24.14 45.96,24.14 45.05,23.23 v44.9,23.23
  Bottom 0.152: v66.08,12.41 65.17,12.41 59.98,7.23 59.98,4.94 J3.2 | v44.9,23.23 44.14,23.99 44.14,27.8 | 44.14,27.8 v44.14,29.94 40.63,33.44 v40.63,35.12 | v41.09,27.04 41.39,27.04 42.15,27.8 44.14,27.8 | v18.07,37.71 19.29,38.93 19.9,38.93 U4.5
  Bottom 0.386: C12.1 19.95,40.6 U4.5 21.95,39.1 C2.+